# Altium project ECG_Multi_Lead.PrjPcb (part 1 of 2)
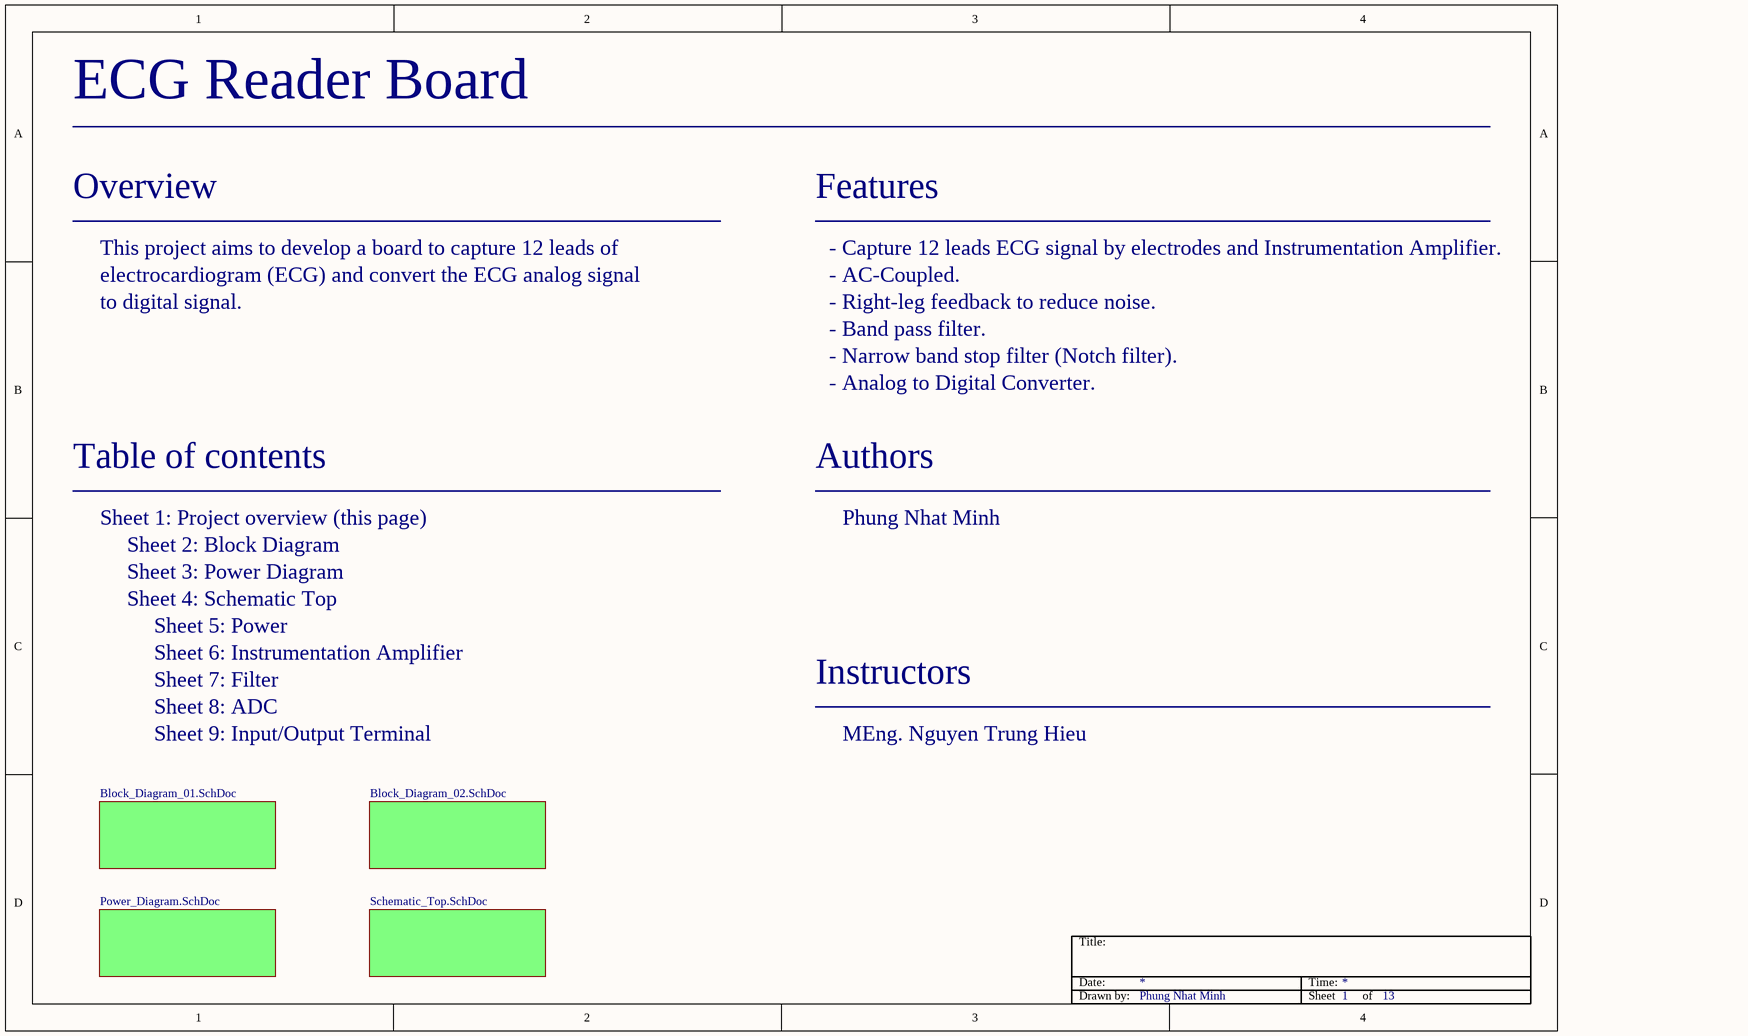
[diagram p0: Project_Overview.SchDoc]
14 sheets, 218 parts. Net scope: flat (ports and power ports of the same name join across sheets).
Board file: PCB_ECG_Multi_Lead.PcbDoc
Sheets:
  Project_Overview.SchDoc
    Designator = Block_Diagram_01.SchDoc
    Designator = Power_Diagram.SchDoc
    Designator = Schematic_Top.SchDoc
      Designator = SCH_03_Instrumentation_Amplifier.SchDoc
      Designator = SCH_08_ADC.SchDoc
      Designator = SCH_01_Power.SchDoc
      Designator = SCH_06_Analog_Mux.SchDoc
      Designator = SCH_09_InOut_Terminal.SchDoc
      Designator = SCH_02_Electrodes.SchDoc
      Designator = SCH_05_WCT_RLD.SchDoc
      Designator = SCH_07_Filter.SchDoc
      Designator = SCH_04_Chest_Lead_Amplifier.SchDoc
    Designator = Block_Diagram_02.SchDoc

## Sheet Project_Overview.SchDoc
size A4; SheetNumber: 1; SheetTotal: 13; BoardName: ECG Reader Board

### Sub-sheets
Designator = Block_Diagram_01.SchDoc: no entries
Designator = Power_Diagram.SchDoc: no entries
Designator = Schematic_Top.SchDoc: no entries
Designator = Block_Diagram_02.SchDoc: no entries

### Notes on the sheet
- Overview
- Features
- This project aims to develop a board to capture 12 leads of
- electrocardiogram (ECG) and convert the ECG analog signal
- to digital signal.
- - Right-leg feedback to reduce noise.
- - AC-Coupled.
- - Capture 12 leads ECG signal by electrodes and Instrumentation Amplifier.
- - Narrow band stop filter (Notch filter).
- - Band pass filter.
- - Analog to Digital Converter.
- Table of contents
- Authors
- Sheet 1: Project overview (this page)
- Sheet 2: Block Diagram
- Sheet 3: Power Diagram
- Phung Nhat Minh
- Sheet 4: Schematic Top
- Sheet 5: Power
- Sheet 7: Filter
- Sheet 6: Instrumentation Amplifier
- Sheet 8: ADC
- Instructors
- Sheet 9: Input/Output Terminal
- MEng. Nguyen Trung Hieu
- Title:
- Date:
- Time:
- Drawn by:
- Sheet
- of

## Sheet Block_Diagram_01.SchDoc
size A4; SheetNumber: 2; SheetTotal: 13
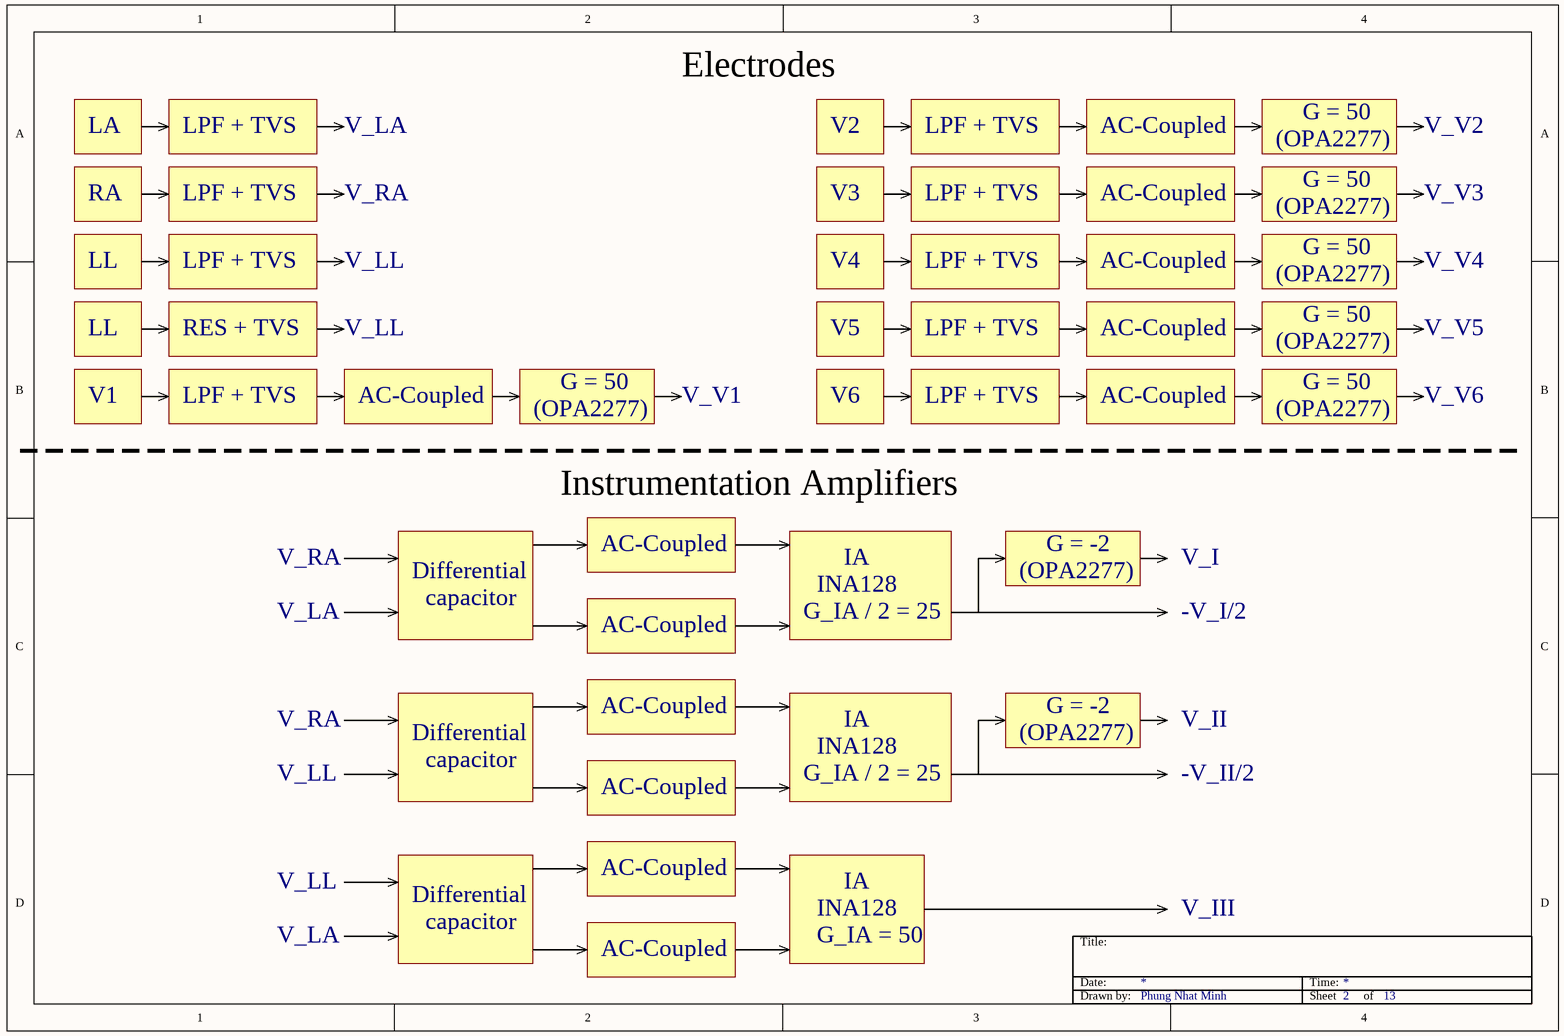
[diagram p1: Block_Diagram_01.SchDoc]

### Notes on the sheet
- Electrodes
- LA
- LPF + TVS
- V_LA
- V2
- AC-Coupled
- (OPA2277)
- G = 50
- V_V2
- RA
- V_RA
- V3
- V_V3
- LL
- V_LL
- V4
- V_V4
- RES + TVS
- V5
- V_V5
- V1
- V_V1
- V6
- V_V6
- Instrumentation Amplifiers
- Differential
- IA
- G = -2
- V_I
- capacitor
- G_IA / 2 = 25
- INA128
- -V_I/2
- V_II
- -V_II/2
- V_III
- G_IA = 50
- Title:
- Date:
- Time:
- Drawn by:
- Phung Nhat Minh
- Sheet
- of

## Sheet Power_Diagram.SchDoc
size A4; SheetNumber: 4; SheetTotal: 14
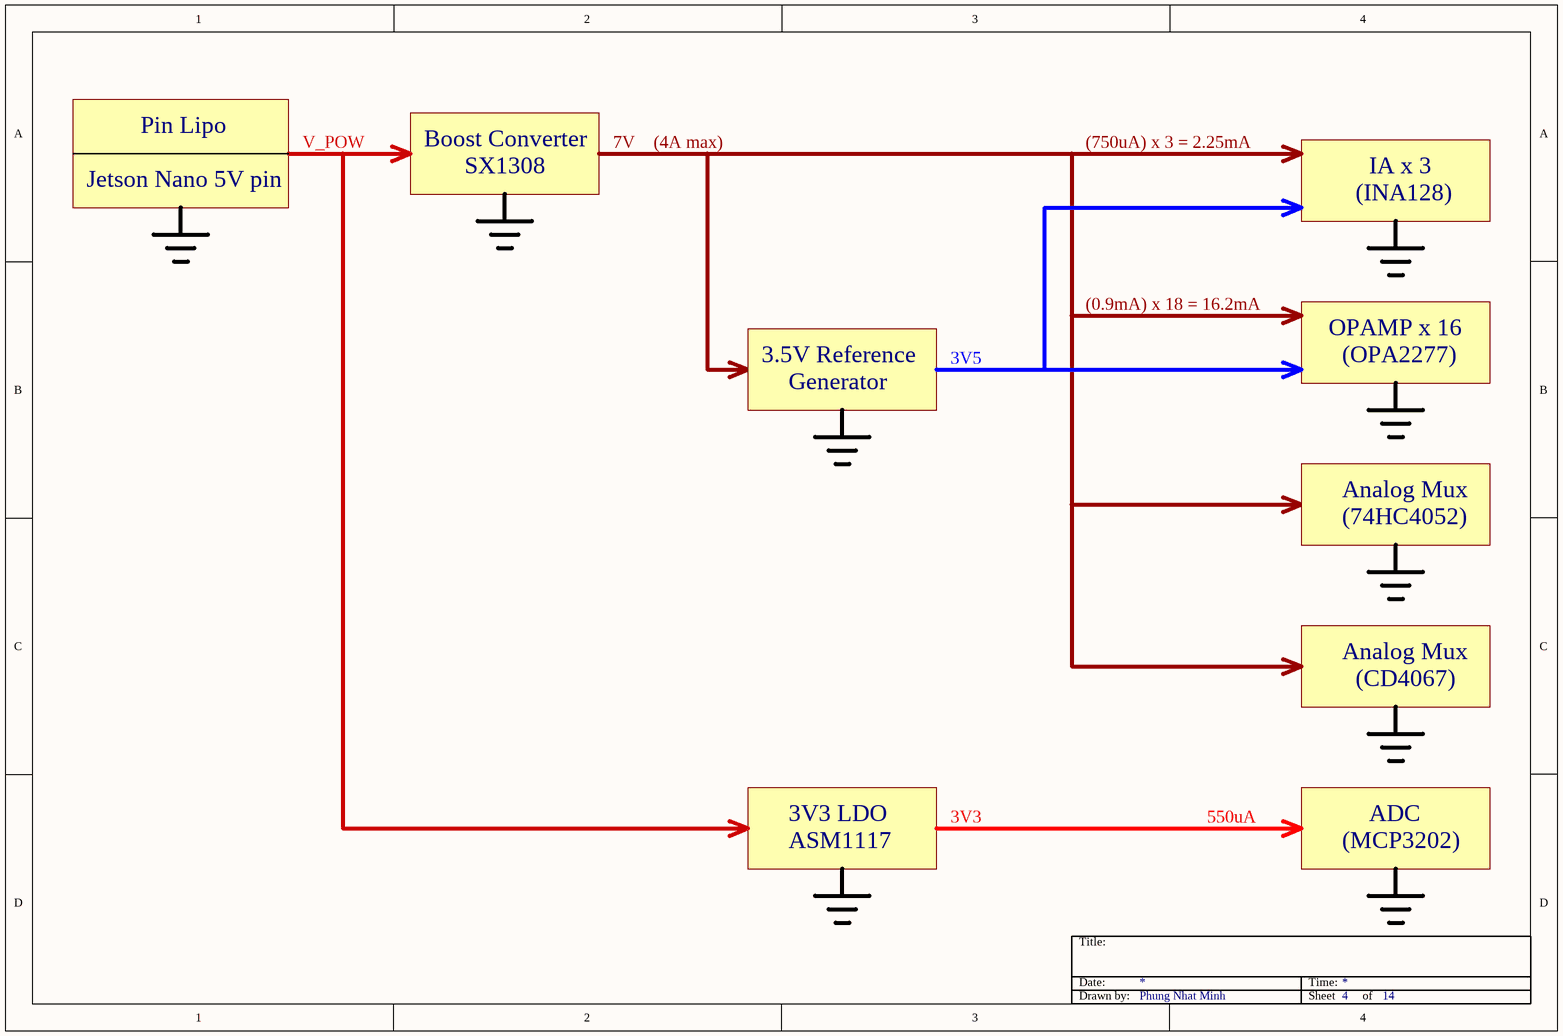
[diagram p2: Power_Diagram.SchDoc]

### Notes on the sheet
- Pin Lipo
- V_POW
- Boost Converter
- SX1308
- 7V
- (4A max)
- (750uA) x 3 = 2.25mA
- IA x 3
- Jetson Nano 5V pin
- (INA128)
- (0.9mA) x 18 = 16.2mA
- 3.5V Reference
- 3V5
- OPAMP x 16
- (OPA2277)
- Generator
- Analog Mux
- (74HC4052)
- (CD4067)
- 3V3 LDO
- ASM1117
- 3V3
- 550uA
- (MCP3202)
- ADC
- Title:
- Date:
- Time:
- Drawn by:
- Phung Nhat Minh
- Sheet
- of

## Sheet Schematic_Top.SchDoc
size A4; SheetNumber: 5; SheetTotal: 14
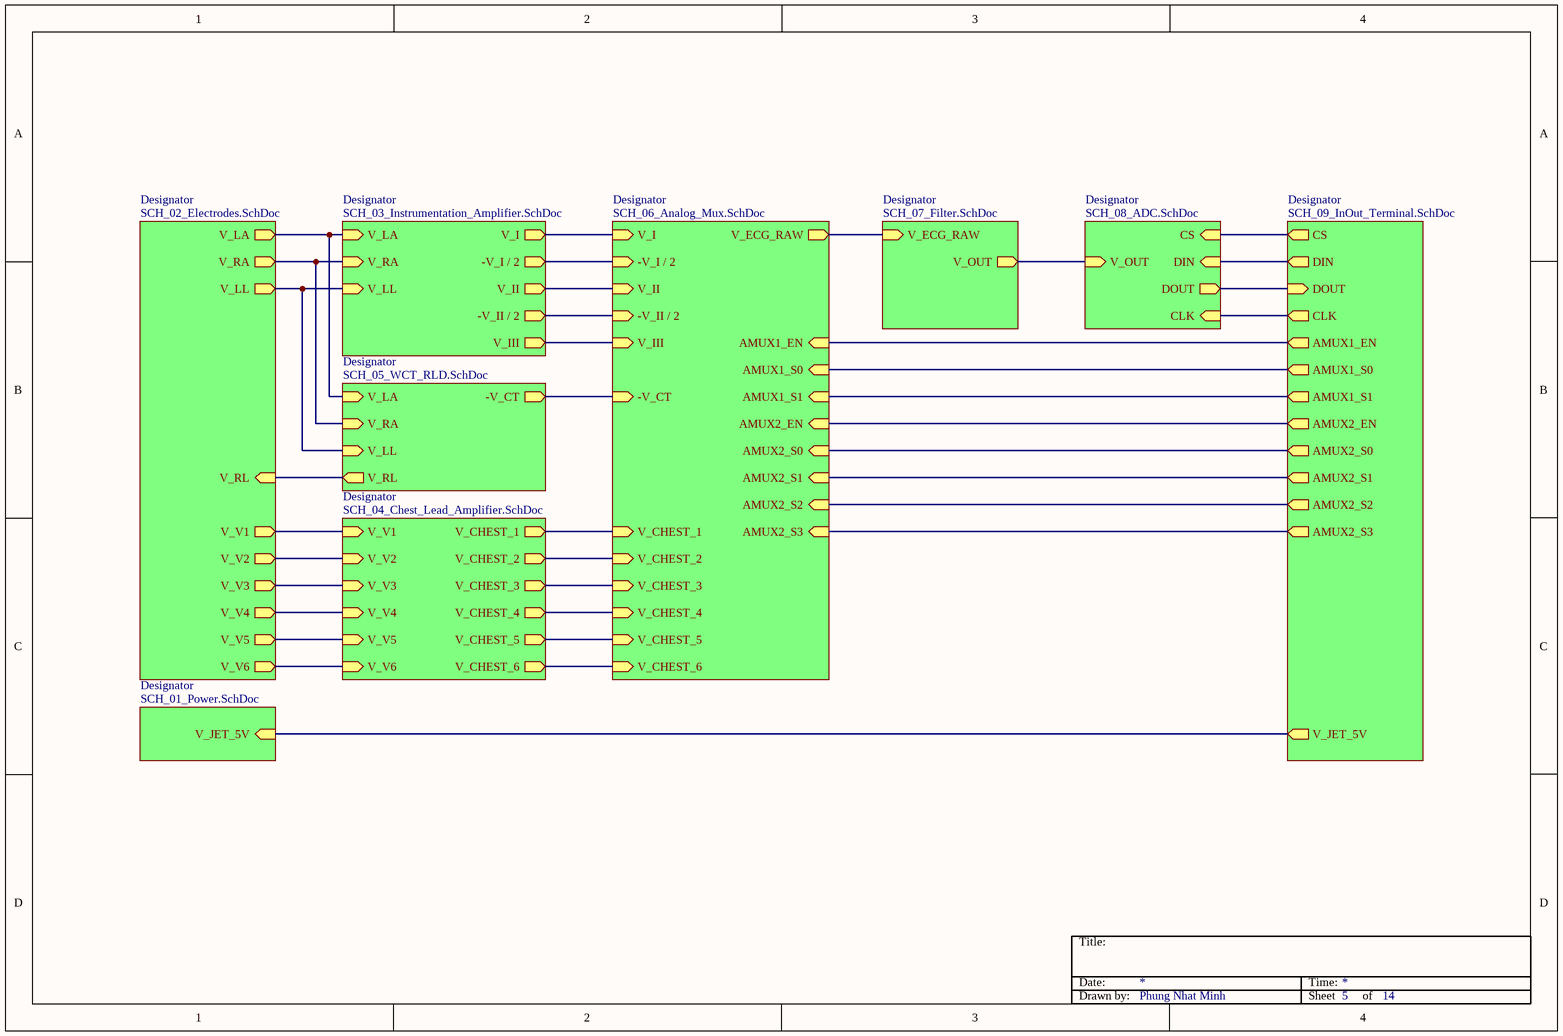
[diagram p3: Schematic_Top.SchDoc]

### Sub-sheets
Designator = SCH_03_Instrumentation_Amplifier.SchDoc: V_I (out), V_LA (in), V_RA (in), V_LL (in), -V_I / 2 (out), V_II (out), -V_II / 2 (out), V_III (out)
Designator = SCH_08_ADC.SchDoc: V_OUT (in), CS (in), DOUT (out), DIN (in), CLK (in)
Designator = SCH_01_Power.SchDoc: V_JET_5V (in)
Designator = SCH_06_Analog_Mux.SchDoc: V_ECG_RAW (out), AMUX1_S0 (in), AMUX1_S1 (in), AMUX2_S0 (in), AMUX2_S1 (in), AMUX2_S2 (in), AMUX2_S3 (in), V_I (in), -V_I / 2 (in), V_II (in), -V_II / 2 (in), V_III (in), -V_CT (in), V_CHEST_1 (in), V_CHEST_2 (in), V_CHEST_3 (in), V_CHEST_4 (in), V_CHEST_5 (in), V_CHEST_6 (in), AMUX2_EN (in), AMUX1_EN (in)
Designator = SCH_09_InOut_Terminal.SchDoc: DIN (out), CS (out), DOUT (in), CLK (out), AMUX1_S0 (out), AMUX1_S1 (out), AMUX2_S0 (out), AMUX2_S1 (out), AMUX2_S2 (out), AMUX2_S3 (out), V_JET_5V (out), AMUX2_EN (out), AMUX1_EN (out)
Designator = SCH_02_Electrodes.SchDoc: V_LA (out), V_RA (out), V_LL (out), V_V1 (out), V_V2 (out), V_V3 (out), V_V4 (out), V_V5 (out), V_V6 (out), V_RL (in)
Designator = SCH_05_WCT_RLD.SchDoc: V_LA (in), V_RA (in), V_LL (in), V_RL (out), -V_CT (out)
Designator = SCH_07_Filter.SchDoc: V_OUT (out), V_ECG_RAW (in)
Designator = SCH_04_Chest_Lead_Amplifier.SchDoc: V_V1 (in), V_V2 (in), V_V3 (in), V_V4 (in), V_V5 (in), V_V6 (in), V_CHEST_1 (out), V_CHEST_2 (out), V_CHEST_3 (out), V_CHEST_4 (out), V_CHEST_5 (out), V_CHEST_6 (out)

### Nets
(unnamed): sheet Designator/V_I, sheet Designator/V_I
(unnamed): sheet Designator/V_LA, sheet Designator/V_LA, sheet Designator/V_LA
(unnamed): sheet Designator/V_RA, sheet Designator/V_RA, sheet Designator/V_RA
(unnamed): sheet Designator/V_LL, sheet Designator/V_LL, sheet Designator/V_LL
(unnamed): sheet Designator/-V_I / 2, sheet Designator/-V_I / 2
(unnamed): sheet Designator/V_II, sheet Designator/V_II
(unnamed): sheet Designator/-V_II / 2, sheet Designator/-V_II / 2
(unnamed): sheet Designator/V_III, sheet Designator/V_III
(unnamed): sheet Designator/V_OUT, sheet Designator/V_OUT
(unnamed): sheet Designator/CS, sheet Designator/CS
(unnamed): sheet Designator/DOUT, sheet Designator/DOUT
(unnamed): sheet Designator/DIN, sheet Designator/DIN
(unnamed): sheet Designator/CLK, sheet Designator/CLK
(unnamed): sheet Designator/V_JET_5V, sheet Designator/V_JET_5V
(unnamed): sheet Designator/V_ECG_RAW, sheet Designator/V_ECG_RAW
(unnamed): sheet Designator/AMUX1_S0, sheet Designator/AMUX1_S0
(unnamed): sheet Designator/AMUX1_S1, sheet Designator/AMUX1_S1
(unnamed): sheet Designator/AMUX2_S0, sheet Designator/AMUX2_S0
(unnamed): sheet Designator/AMUX2_S1, sheet Designator/AMUX2_S1
(unnamed): sheet Designator/AMUX2_S2, sheet Designator/AMUX2_S2
(unnamed): sheet Designator/AMUX2_S3, sheet Designator/AMUX2_S3
(unnamed): sheet Designator/-V_CT, sheet Designator/-V_CT
(unnamed): sheet Designator/V_CHEST_1, sheet Designator/V_CHEST_1
(unnamed): sheet Designator/V_CHEST_2, sheet Designator/V_CHEST_2
(unnamed): sheet Designator/V_CHEST_3, sheet Designator/V_CHEST_3
(unnamed): sheet Designator/V_CHEST_4, sheet Designator/V_CHEST_4
(unnamed): sheet Designator/V_CHEST_5, sheet Designator/V_CHEST_5
(unnamed): sheet Designator/V_CHEST_6, sheet Designator/V_CHEST_6
(unnamed): sheet Designator/AMUX2_EN, sheet Designator/AMUX2_EN
(unnamed): sheet Designator/AMUX1_EN, sheet Designator/AMUX1_EN
(unnamed): sheet Designator/V_V1, sheet Designator/V_V1
(unnamed): sheet Designator/V_V2, sheet Designator/V_V2
(unnamed): sheet Designator/V_V3, sheet Designator/V_V3
(unnamed): sheet Designator/V_V4, sheet Designator/V_V4
(unnamed): sheet Designator/V_V5, sheet Designator/V_V5
(unnamed): sheet Designator/V_V6, sheet Designator/V_V6
(unnamed): sheet Designator/V_RL, sheet Designator/V_RL

### Notes on the sheet
- Title:
- Date:
- Time:
- Drawn by:
- Phung Nhat Minh
- Sheet
- of

## Sheet SCH_03_Instrumentation_Amplifier.SchDoc
size A4; SheetNumber: 8; SheetTotal: 14; SPICEModelCacheUCDMULDR: <root> / <DocumentId>UCDMULDR</DocumentId> / </root>
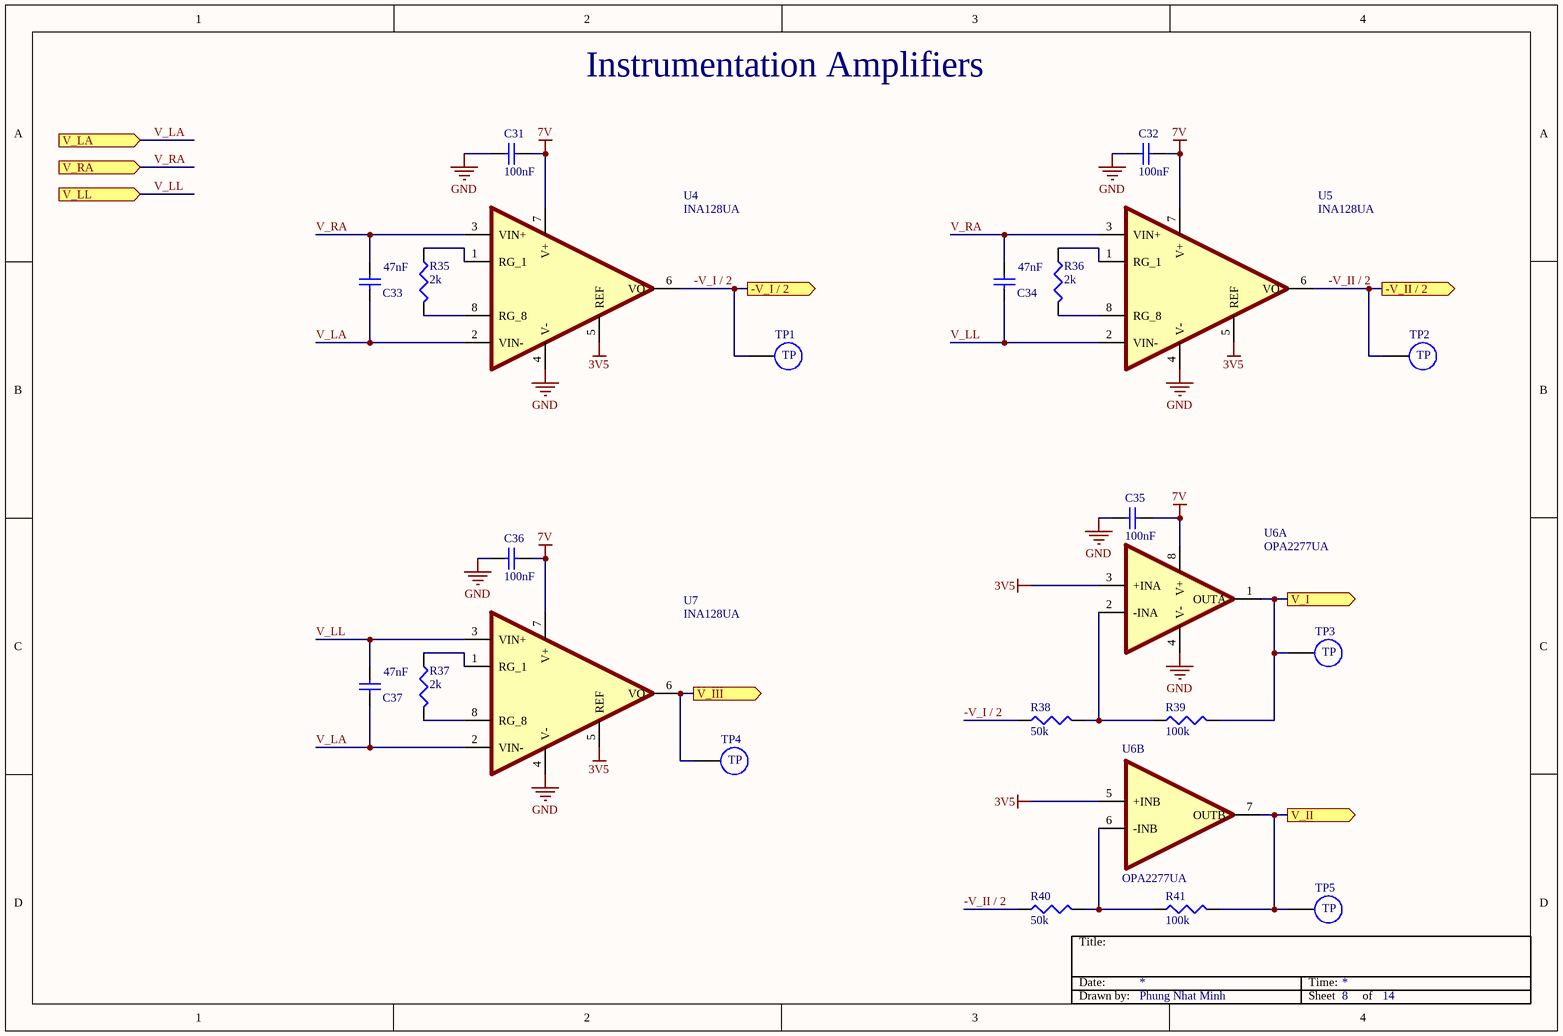
[diagram p4: SCH_03_Instrumentation_Amplifier.SchDoc]

### Parts
C31  100nF  [WCAP-CSGP_0603_L1.6W0.8H0.8_Reflow]
C32  100nF  [WCAP-CSGP_0603_L1.6W0.8H0.8_Reflow]
C33  47nF  [WCAP-CSGP_0603_L1.6W0.8H0.8_Reflow]
C34  47nF  [WCAP-CSGP_0603_L1.6W0.8H0.8_Reflow]
C35  100nF  [WCAP-CSGP_0603_L1.6W0.8H0.8_Reflow]
C36  100nF  [WCAP-CSGP_0603_L1.6W0.8H0.8_Reflow]
C37  47nF  [WCAP-CSGP_0603_L1.6W0.8H0.8_Reflow]
R35  2k  [WRIS-PSMB_0603_L1.6W0.8H0.35]
R36  2k  [WRIS-PSMB_0603_L1.6W0.8H0.35]
R37  2k  [WRIS-PSMB_0603_L1.6W0.8H0.35]
R38  50k  [WRIS-PSMB_0603_L1.6W0.8H0.35]
R39  100k  [WRIS-PSMB_0603_L1.6W0.8H0.35]
R40  50k  [WRIS-PSMB_0603_L1.6W0.8H0.35]
R41  100k  [WRIS-PSMB_0603_L1.6W0.8H0.35]
TP1  Pad_Test_Point  [Pad_Test_Point]  (value not drawn)
TP2  Pad_Test_Point  [Pad_Test_Point]  (value not drawn)
TP3  Pad_Test_Point  [Pad_Test_Point]  (value not drawn)
TP4  Pad_Test_Point  [Pad_Test_Point]  (value not drawn)
TP5  Pad_Test_Point  [Pad_Test_Point]  (value not drawn)
U4  INA128UA  [SOIC127P599X175-8N]
U5  INA128UA  [SOIC127P599X175-8N]
U6  OPA2277UA  [SOIC127P599X175-8N]  (parts A,B of 2)
U7  INA128UA  [SOIC127P599X175-8N]

### Ports
-V_I / 2 (out, see Schematic_Top[2B], SCH_06_Analog_Mux[2B]), -V_II / 2 (out, see Schematic_Top[2B], SCH_06_Analog_Mux[2C]), V_I (out, see Schematic_Top[2A], SCH_06_Analog_Mux[2B]), V_II (out, see Schematic_Top[2B], SCH_06_Analog_Mux[2C]), V_III (out, see Schematic_Top[2B], SCH_06_Analog_Mux[2C]), V_LA (in, see Schematic_Top[1A], SCH_02_Electrodes[2A], SCH_05_WCT_RLD[1A]), V_LL (in, see Schematic_Top[1B], SCH_02_Electrodes[2B], SCH_05_WCT_RLD[1B]), V_RA (in, see Schematic_Top[1B], SCH_02_Electrodes[2A], SCH_05_WCT_RLD[1B])

### Nets
3V5: U4.5(REF) U5.5(REF) U6.3(+INA) U6.5(+INB) U7.5(REF)
7V: C31.1 C32.1 C35.1 C36.1 U4.7(V+) U5.7(V+) U6.8(V+) U7.7(V+)
GND: C31.2 C32.2 C35.2 C36.2 U4.4(V-) U5.4(V-) U6.4(V-) U7.4(V-)
-V_I / 2: R38.1 TP1.1 U4.6(VO) ; port -V_I / 2
-V_II / 2: R40.1 TP2.1 U5.6(VO) ; port -V_II / 2
V_LA: C33.1 C37.1 U4.2(VIN-) U7.2(VIN-) ; port V_LA
V_LL: C34.1 C37.2 U5.2(VIN-) U7.3(VIN+) ; port V_LL
V_RA: C33.2 C34.2 U4.3(VIN+) U5.3(VIN+) ; port V_RA
NetR35_1: R35.1 U4.1(RG_1)
NetR35_2: R35.2 U4.8(RG_8)
NetR36_1: R36.1 U5.1(RG_1)
NetR36_2: R36.2 U5.8(RG_8)
NetR37_1: R37.1 U7.1(RG_1)
NetR37_2: R37.2 U7.8(RG_8)
NetR38_2: R38.2 R39.1 U6.2(-INA)
NetR39_2: R39.2 TP3.1 U6.1(OUTA) ; port V_I
NetR40_2: R40.2 R41.1 U6.6(-INB)
NetR41_2: R41.2 TP5.1 U6.7(OUTB) ; port V_II
NetTP4_1: TP4.1 U7.6(VO) ; port V_III

### Notes on the sheet
- Instrumentation Amplifiers
- Title:
- Date:
- Time:
- Drawn by:
- Phung Nhat Minh
- Sheet
- of
- (in symbol Pad_Test_Point) TP

### Library data of the parts
C31 C32 C35 C36 = 885012206095: WCAP-CSGP Multilayer Ceramic Chip Capacitor, General Purpose, size 0603, X7R, 100nF, 50VDC; Manufacturer: Wurth Elektronik; Case/Size Code: 0603; Capacitance Tolerance: +/-10%; Dissipation Factor: 3%; Insulation Resistance: 5GOhm; Rated Voltage (DC): 50V; Technical Reference: X7R0603104K050DFCT10000; Manufacturer Part Number: 885012206095; Category: Multilayer Ceramic Chip Capacitors; Match Code: WCAP-CSGP; ComponentLink1Description: Website Link; ComponentLink1URL: https://www.we-online.com/redexpert/article/885012206095?ad; ComponentLink2Description: Datasheet Link; ComponentLink2URL: https://www.we-online.com/redexpert/spec/885012206095?ad; Mount: Surface Mount; Operating Temperature Max: 125°C; Operating Temperature Min: -55°C; Packaging: Tape and Reel; Length: 1.6mm; Width: 0.8mm; Height: 0.8mm; Capacitance: 100nF; Ceramic Type: X7R
C33 C34 C37 = 885012206093: WCAP-CSGP Multilayer Ceramic Chip Capacitor, General Purpose, size 0603, X7R, 47nF, 50VDC; Manufacturer: Wurth Elektronik; Case/Size Code: 0603; Capacitance Tolerance: +/-10%; Dissipation Factor: 3%; Insulation Resistance: 10GOhm; Rated Voltage (DC): 50V; Technical Reference: X7R0603473K050DFCT10000; Manufacturer Part Number: 885012206093; Category: Multilayer Ceramic Chip Capacitors; Match Code: WCAP-CSGP; ComponentLink1Description: Website Link; ComponentLink1URL: https://www.we-online.com/redexpert/article/885012206093?ad; ComponentLink2Description: Datasheet Link; ComponentLink2URL: https://www.we-online.com/redexpert/spec/885012206093?ad; Mount: Surface Mount; Operating Temperature Max: 125°C; Operating Temperature Min: -55°C; Packaging: Tape and Reel; Length: 1.6mm; Width: 0.8mm; Height: 0.8mm; Capacitance: 47nF; Ceramic Type: X7R
R35-R41 = 580060716001: WRIS-PSMB Metal Plate Resistor, SMT, size 0603, 0.33W, 5mΩ, +/-1%; Manufacturer: Wurth Elektronik; Case/Size Code: 0603; Rated Current: 8.12A; Technical Reference: MB0603R005F103KAATP0000; Temperature Coefficient of Resistance: +/-100ppm/°C; Manufacturer Part Number: 580060716001; Category: Metal Plate Resistors; Match Code: WRIS-PSMB; ComponentLink1Description: Website Link; ComponentLink1URL: https://www.we-online.com/redexpert/article/580060716001?ad; ComponentLink2Description: Datasheet Link; ComponentLink2URL: https://www.we-online.com/redexpert/spec/580060716001?ad; Mount: Surface Mount; Operating Temperature Max: 155°C; Operating Temperature Min: -55°C; Packaging: Tape and Reel; Length: 1.6mm; Width: 0.8mm; Height: 0.35mm; Rated Power: 0.33W; Resistance: 5mΩ; Resistance Tolerance: +/-1%
U4 U5 U7 = INA128UA: Precision, 130-dB CMRR, 700-A, Low-Power, Instrumentation Amplifier 8-SOIC -40 to 125; MP: INA128UA/2K5; MF: Texas Instruments; Value: *; Package: SOIC-8 Texas Instruments; Availability: Good; SnapEDA_Link: https://www.snapeda.com/parts/INA128UA/2K5/Texas%20Instruments/view-part/1191532/?ref=snap; Price: None; Purchase-URL: https://pricing.snapeda.com/search/part/INA128UA/2K5/?ref=eda
U6 = OPA2277UA: MP: OPA2227UA; Package: None; Price: None; Value: *; Availability: Unavailable

## Sheet SCH_08_ADC.SchDoc
size A4; SheetNumber: 13; SheetTotal: 14; SPICEModelCacheAFFBQUIG: <root> / <DocumentId>AFFBQUIG</DocumentId> / <CacheFrame Number="0"> / <Model Name="0603_885012106031_10uf" Kind="CKT"> / <Text>******* / .subckt 0603_885012106031_10uF 1 2 / Rser 1 3 0.0105 / Lser 2 4 0.0000000008 / C1 3 4 0.00001 / Rpar 3 4 10000000 / .ends 0603_885012106031_10uF</Text> / </Model> / <Model Name="0603_885012206095_100nf" Kind="CKT"> / <Text>******* / .subckt 0603_885012206095_100nF 1 2 / Rser 1 3 0.0157659152881 / Lser 2 4 3.10171966E-10 / C1 3 4 0.0000001 / Rpar 3 4 5000000000 / .ends 0603_885012206095_100nF</Text> / </Model> / </CacheFrame> / </root>
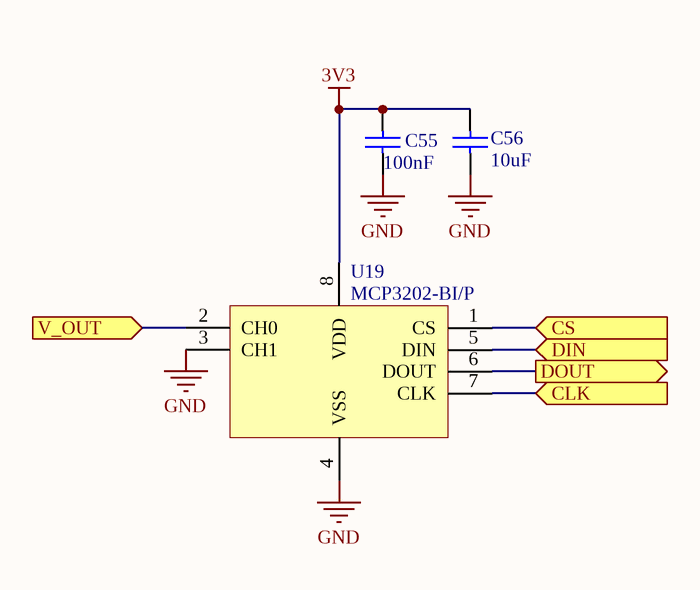
[diagram p5: SCH_08_ADC.SchDoc]

### Parts
C55  100nF  [WCAP-CSGP_0603_L1.6W0.8H0.8_Reflow]
C56  10uF  [WCAP-CSGP_0603_L1.6W0.8H0.8_Reflow]
U19  MCP3202-BI/P  [DIP787W46P254L927H533Q8]

### Ports
CLK (in, see Schematic_Top[4B], SCH_09_InOut_Terminal[3B]), CS (in, see Schematic_Top[4A], SCH_09_InOut_Terminal[2B]), DIN (in, see Schematic_Top[4B], SCH_09_InOut_Terminal[3B]), DOUT (out, see Schematic_Top[4B], SCH_09_InOut_Terminal[3B]), V_OUT (in, see Schematic_Top[3B], SCH_07_Filter[4B])

### Nets
3V3: C55.2 C56.2 U19.8(VDD)
GND: C55.1 C56.1 U19.3(CH1) U19.4(VSS)
NetJ5_19: U19.5(DIN) ; port DIN
NetJ5_21: U19.6(DOUT) ; port DOUT
NetJ5_23: U19.7(CLK) ; port CLK
NetJ5_26: U19.1(CS) ; port CS
NetR89_1: U19.2(CH0) ; port V_OUT

### Notes on the sheet
- Title:
- Date:
- Time:
- Drawn by:
- Phung Nhat Minh
- Sheet
- of

### Library data of the parts
C55 = 885012206095: as C31 on sheet SCH_03_Instrumentation_Amplifier; Manufacturer Part Number: 885012206095; Category: Multilayer Ceramic Chip Capacitors; Match Code: WCAP-CSGP; ComponentLink1Description: Website Link; ComponentLink1URL: https://www.we-online.com/redexpert/article/885012206095?ad; ComponentLink2Description: Datasheet Link; ComponentLink2URL: https://www.we-online.com/redexpert/spec/885012206095?ad; Mount: Surface Mount; Operating Temperature Max: 125°C; Operating Temperature Min: -55°C; Packaging: Tape and Reel; Length: 1.6mm; Width: 0.8mm; Height: 0.8mm; Capacitance: 100nF; Ceramic Type: X7R
C56 = 885012106031: WCAP-CSGP Multilayer Ceramic Chip Capacitor, General Purpose, size 0603, X5R, 10uF, 25VDC; Manufacturer: Wurth Elektronik; Case/Size Code: 0603; Capacitance Tolerance: +/20%; Dissipation Factor: 20%; Insulation Resistance: 0.01GOhm; Rated Voltage (DC): 25V; Technical Reference: X5R0603106M025DFCT10000; Manufacturer Part Number: 885012106031; Category: Multilayer Ceramic Chip Capacitors; Match Code: WCAP-CSGP; ComponentLink1Description: Website Link; ComponentLink1URL: https://www.we-online.com/redexpert/article/885012106031?ad; ComponentLink2Description: Datasheet Link; ComponentLink2URL: https://www.we-online.com/redexpert/spec/885012106031?ad; Mount: Surface Mount; Operating Temperature Max: 85°C; Operating Temperature Min: -55°C; Packaging: Tape and Reel; Length: 1.6mm; Width: 0.8mm; Height: 0.8mm; Capacitance: 10uF; Ceramic Type: X5R

## Sheet SCH_01_Power.SchDoc
size A4; SheetNumber: 6; SheetTotal: 14; SPICEModelCacheESGLKFNC: <root> / <DocumentId>ESGLKFNC</DocumentId> / </root>
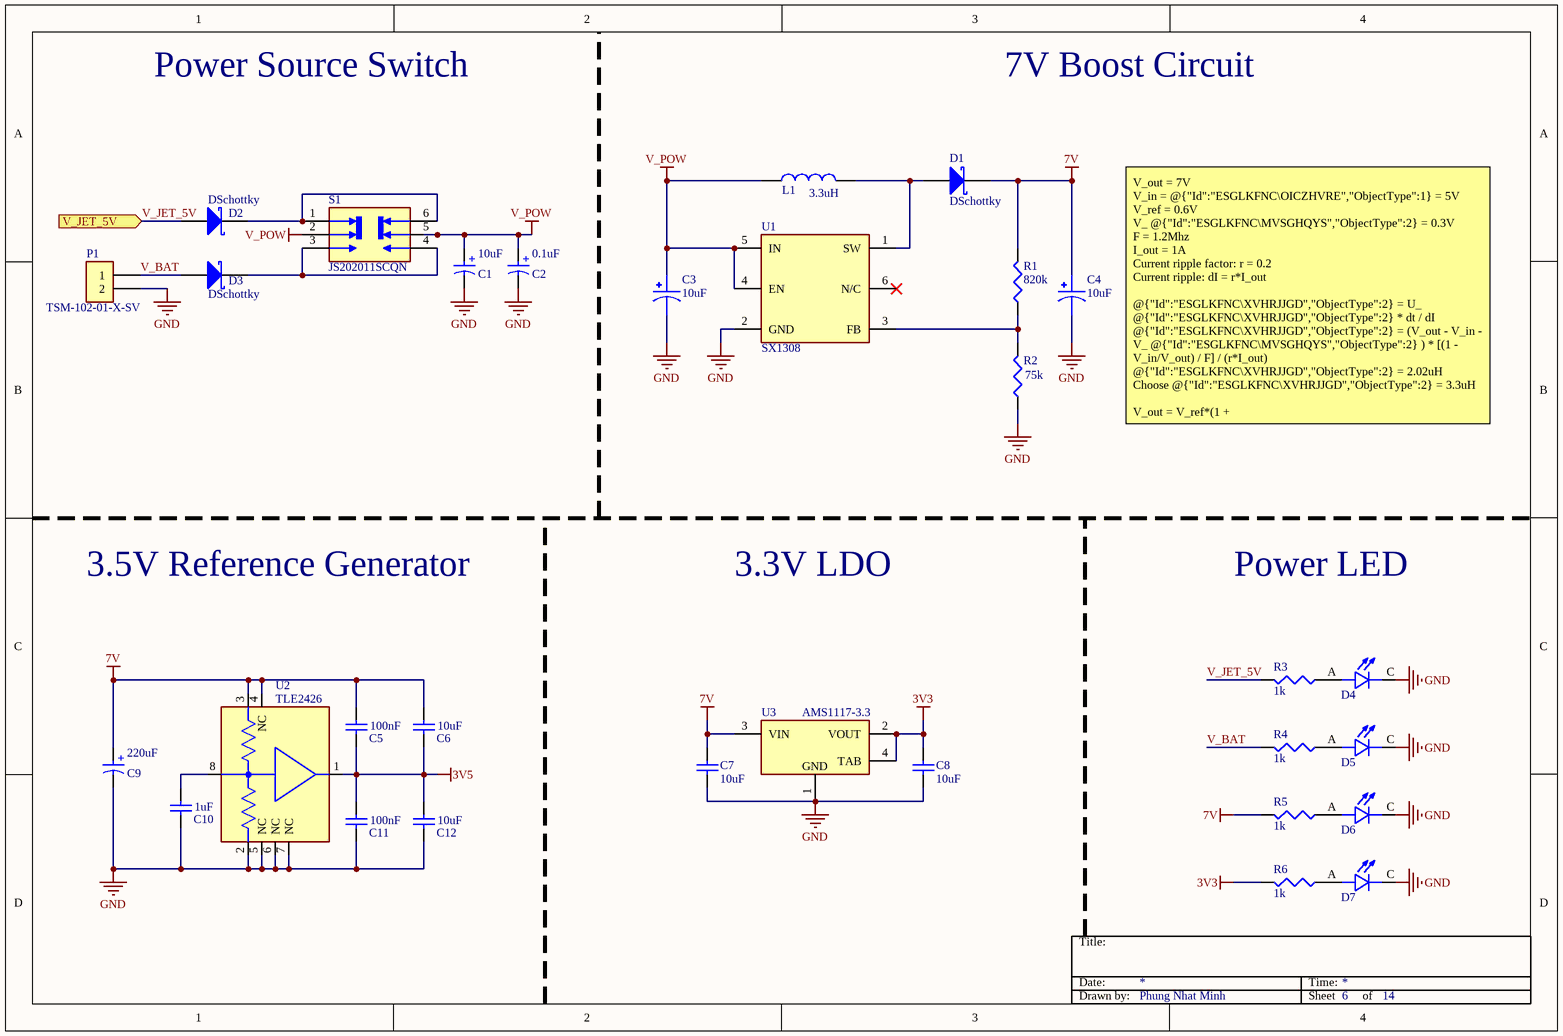
[diagram p6: SCH_01_Power.SchDoc]

### Parts
C1  10uF  [WCAP-ASLI_D4H5.5]
C2  0.1uF  [WCAP-ASLI_D4H5.5]
C3  10uF  [CAPPM6032X280N]
C4  10uF  [CAPPM6032X280N]
C5  100nF  [WCAP-CSGP_0603_L1.6W0.8H0.8_Reflow]
C6  10uF  [WCAP-CSGP_0603_L1.6W0.8H0.8_Reflow]
C7  10uF  [WCAP-CSGP_0603_L1.6W0.8H0.8_Reflow]
C8  10uF  [WCAP-CSGP_0603_L1.6W0.8H0.8_Reflow]
C9  220uF  [WCAP-ASLI_D6.3H7.7]
C10  1uF  [WCAP-CSGP_0603_L1.6W0.8H0.8_Reflow]
C11  100nF  [WCAP-CSGP_0603_L1.6W0.8H0.8_Reflow]
C12  10uF  [WCAP-CSGP_0603_L1.6W0.8H0.8_Reflow]
D1  DSchottky  [PCBComponent_1]
D2  DSchottky  [PCBComponent_1]
D3  DSchottky  [PCBComponent_1]
D4  SML-LXT0805IW-TR  [LEDC2012X120N]  (value not drawn)
D5  SML-LXT0805IW-TR  [LEDC2012X120N]  (value not drawn)
D6  SML-LXT0805IW-TR  [LEDC2012X120N]  (value not drawn)
D7  SML-LXT0805IW-TR  [LEDC2012X120N]  (value not drawn)
L1  3.3uH  [WE-PD2A_4532]
P1  TSM-102-01-X-SV  [SAMTEC_TSM-102-01-X-SV]
R1  820k  [WRIS-PSMB_0603_L1.6W0.8H0.35]
R2  75k  [WRIS-PSMB_0603_L1.6W0.8H0.35]
R3  1k  [WRIS-PSMB_0603_L1.6W0.8H0.35]
R4  1k  [WRIS-PSMB_0603_L1.6W0.8H0.35]
R5  1k  [WRIS-PSMB_0603_L1.6W0.8H0.35]
R6  1k  [WRIS-PSMB_0603_L1.6W0.8H0.35]
S1  JS202011SCQN  [SW_JS202011SCQN]
U1  SX1308  [SOT-23-6]
U2  TLE2426  [SO8]
U3  AMS1117-3.3  [SOT229P700X180-4N]

### Ports
V_JET_5V (in, see Schematic_Top[1C], SCH_09_InOut_Terminal[2C])

### Nets
3V3: C8.2 R6.2 U3.2(VOUT) U3.4(TAB)
3V5: C5.1 C6.1 C11.2 C12.2 U2.1(OUT)
7V: C4.1 C5.2 C6.2 C7.2 C9.1(P) D1.2(K) R1.2 R5.2 U2.3(V+) U2.4(NC) U3.3(VIN)
GND: C1.2(N) C2.2(N) C3.2 C4.2 C7.1 C8.1 C9.2(N) C10.1 C11.1 C12.1 D4.C D5.C D6.C D7.C P1.2 R2.1 U1.2(GND) U2.2(V-) U2.5(NC) U2.6(NC) U2.7(NC) U3.1(GND/ADJ)
V_POW: C1.1(P) C2.1(P) C3.1 L1.1 S1.2 S1.5 U1.4(EN) U1.5(IN)
V_BAT: D3.1(A) P1.1 R4.2
V_JET_5V: D2.1(A) R3.2 ; port V_JET_5V
NetC10_2: C10.2 U2.8(NR)
NetD1_1: D1.1(A) L1.2 U1.1(SW)
NetD2_2: D2.2(K) S1.1 S1.6
NetD3_2: D3.2(K) S1.3 S1.4
NetD4_A: D4.A R3.1
NetD5_A: D5.A R4.1
NetD6_A: D6.A R5.1
NetD7_A: D7.A R6.1
NetR1_1: R1.1 R2.2 U1.3(FB)

Not connected (* = marked no-connect by the designer): U1 6(N/C)*

### Notes on the sheet
- Power Source Switch
- 7V Boost Circuit
- V_out = 7V
  V_in = @{"Id":"ESGLKFNC\OICZHVRE","ObjectType":1} = 5V
  V_ref = 0.6V
  V_ @{"Id":"ESGLKFNC\MVSGHQYS","ObjectType":2} = 0.3V
  F = 1.2Mhz
  I_out = 1A
  Current ripple factor: r = 0.2
  Current ripple: dI = r*I_out
  @{"Id":"ESGLKFNC\XVHRJJGD","ObjectType":2} = U_ @{"Id":"ESGLKFNC\XVHRJJGD","ObjectType":2} * dt / dI
  @{"Id":"ESGLKFNC\XVHRJJGD","ObjectType":2} = (V_out - V_in - V_ @{"Id":"ESGLKFNC\MVSGHQYS","ObjectType":2} ) * [(1 - V_in/V_out) / F] / (r*I_out)
  @{"Id":"ESGLKFNC\XVHRJJGD","ObjectType":2} = 2.02uH
  Choose @{"Id":"ESGLKFNC\XVHRJJGD","ObjectType":2} = 3.3uH
  V_out = V_ref*(1 + @{"Id":"ESGLKFNC\TLFOOIWW","ObjectType":2} / @{"Id":"ESGLKFNC\CCQALEBM","ObjectType":2} )
  @{"Id":"ESGLKFNC\TLFOOIWW","ObjectType":2} + @{"Id":"ESGLKFNC\CCQALEBM","ObjectType":2} ≈ 1M
  Choose @{"Id":"ESGLKFNC\TLFOOIWW","ObjectType":2} = 820k, @{"Id":"ESGLKFNC\CCQALEBM","ObjectType":2} = 75k.
- 3.5V Reference Generator
- 3.3V LDO
- Power LED
- Title:
- Date:
- Time:
- Drawn by:
- Phung Nhat Minh
- Sheet
- of
- (in symbol 865080245009) +
- (in symbol 865080440002) +
- (in symbol 865080740002) +
- (in symbol AMS1117-5.0) GND

### Library data of the parts
C1 = 865080440002: WCAP-ASLI Aluminum Electrolytic Capacitor, V-Chip, D4 x H5.5mm, 10uF, 25V; Manufacturer: Wurth Elektronik; Capacitance Tolerance: +/-20%; Dissipation Factor: 14%; Endurance: 2000h; Leakage Current: 3uA; Ripple Current: 85mA; Technical Reference: ASEB055100M025DVCTAB000; Manufacturer Part Number: 865080440002; Category: Aluminum Electrolytic Capacitors; Match Code: WCAP-ASLI; ComponentLink1Description: Website Link; ComponentLink1URL: https://www.we-online.com/redexpert/article/865080440002?ad; ComponentLink2Description: Datasheet Link; ComponentLink2URL: https://www.we-online.com/redexpert/spec/865080440002?ad; Mount: Surface Mount; Operating Temperature Max: 105°C; Operating Temperature Min: -55°C; Packaging: Tape and Reel; Height: 5.5mm; Diameter: 4mm; Capacitance: 10uF; Rated Voltage (DC): 25V
C2 = 865080740002: WCAP-ASLI Aluminum Electrolytic Capacitor, V-Chip, D4 x H5.5mm, 0.1uF, 63V; Manufacturer: Wurth Elektronik; Capacitance Tolerance: +/-20%; Dissipation Factor: 12%; Endurance: 2000h; Leakage Current: 3uA; Ripple Current: 1mA; Technical Reference: ASEB055R10M063DVCTAB000; Manufacturer Part Number: 865080740002; Category: Aluminum Electrolytic Capacitors; Match Code: WCAP-ASLI; ComponentLink1Description: Website Link; ComponentLink1URL: https://www.we-online.com/redexpert/article/865080740002?ad; ComponentLink2Description: Datasheet Link; ComponentLink2URL: https://www.we-online.com/redexpert/spec/865080740002?ad; Mount: Surface Mount; Operating Temperature Max: 105°C; Operating Temperature Min: -55°C; Packaging: Tape and Reel; Height: 5.5mm; Diameter: 4mm; Capacitance: 0.1uF; Rated Voltage (DC): 63V
C3 C4 = TAJC106K016RNJ: 10µF Molded Tantalum Capacitors 16V 2312 (6032 Metric) 2Ohm; MF: AVX Interconnect / Elco; Value: *; MP: TAJC106K016RNJ; Package: 2312 AVX Interconnect / Elco; SnapEDA_Link: https://www.snapeda.com/parts/TAJC106K016RNJ/AVX%20Interconnect%20/%20Elco/view-part/4773/?ref=snap; Price: None; Availability: Unavailable; Check_prices: https://www.snapeda.com/parts/TAJC106K016RNJ/AVX%20Interconnect%20/%20Elco/view-part/4773/?ref=eda
C5 C11 = 885012206095: as C31 on sheet SCH_03_Instrumentation_Amplifier; Manufacturer Part Number: 885012206095; Category: Multilayer Ceramic Chip Capacitors; Match Code: WCAP-CSGP; ComponentLink1Description: Website Link; ComponentLink1URL: https://www.we-online.com/redexpert/article/885012206095?ad; ComponentLink2Description: Datasheet Link; ComponentLink2URL: https://www.we-online.com/redexpert/spec/885012206095?ad; Mount: Surface Mount; Operating Temperature Max: 125°C; Operating Temperature Min: -55°C; Packaging: Tape and Reel; Length: 1.6mm; Width: 0.8mm; Height: 0.8mm; Capacitance: 100nF; Ceramic Type: X7R
C6-C8 C12 = 885012106031: as C56 on sheet SCH_08_ADC; Manufacturer Part Number: 885012106031; Category: Multilayer Ceramic Chip Capacitors; Match Code: WCAP-CSGP; ComponentLink1Description: Website Link; ComponentLink1URL: https://www.we-online.com/redexpert/article/885012106031?ad; ComponentLink2Description: Datasheet Link; ComponentLink2URL: https://www.we-online.com/redexpert/spec/885012106031?ad; Mount: Surface Mount; Operating Temperature Max: 85°C; Operating Temperature Min: -55°C; Packaging: Tape and Reel; Length: 1.6mm; Width: 0.8mm; Height: 0.8mm; Capacitance: 10uF; Ceramic Type: X5R
C9 = 865080245009: WCAP-ASLI Aluminum Electrolytic Capacitor, V-Chip, D6.3 x H7.7mm, 220uF, 10V; Manufacturer: Wurth Elektronik; Capacitance Tolerance: +/-20%; Dissipation Factor: 19%; Endurance: 2000h; Leakage Current: 22uA; Ripple Current: 270mA; Technical Reference: ASED077221M010DVCTCB000; Manufacturer Part Number: 865080245009; Category: Aluminum Electrolytic Capacitors; Match Code: WCAP-ASLI; ComponentLink1Description: Website Link; ComponentLink1URL: https://www.we-online.com/redexpert/article/865080245009?ad; ComponentLink2Description: Datasheet Link; ComponentLink2URL: https://www.we-online.com/redexpert/spec/865080245009?ad; Mount: Surface Mount; Operating Temperature Max: 105°C; Operating Temperature Min: -55°C; Packaging: Tape and Reel; Height: 7.7mm; Diameter: 6.3mm; Capacitance: 220uF; Rated Voltage (DC): 10V
C10 = 885012206126: WCAP-CSGP Multilayer Ceramic Chip Capacitor, General Purpose, size 0603, X7R, 1uF, 50VDC; Manufacturer: Wurth Elektronik; Case/Size Code: 0603; Capacitance Tolerance: +/-10%; Dissipation Factor: 10%; Insulation Resistance: 0.5GOhm; Rated Voltage (DC): 50V; Technical Reference: X7R0603105K050DFCT10000; Manufacturer Part Number: 885012206126; Category: Multilayer Ceramic Chip Capacitors; Match Code: WCAP-CSGP; ComponentLink1Description: Website Link; ComponentLink1URL: https://www.we-online.com/redexpert/article/885012206126?ad; ComponentLink2Description: Datasheet Link; ComponentLink2URL: https://www.we-online.com/redexpert/spec/885012206126?ad; Mount: Surface Mount; Operating Temperature Max: 125°C; Operating Temperature Min: -55°C; Packaging: Tape and Reel; Length: 1.6mm; Width: 0.8mm; Height: 0.8mm; Capacitance: 1uF; Ceramic Type: X7R
D4-D7 = SML-LXT0805IW-TR: LED;Red;11mcd;0.061In.Dia.;SMD;100mA;2V Vf;635nm;140deg;SMD;White Diffused;5V Vr | Lumex SML-LXT0805IW-TR; MF: Lumex Opto/Components; SnapEDA_Link: https://www.snapeda.com/parts/SML-LXT0805IW-TR/Lumex+Opto%252FComponents+Inc./view-part/?ref=snap; Package: 0805 Lumex; Value: *; MP: SML-LXT0805IW-TR; Check_prices: https://www.snapeda.com/parts/SML-LXT0805IW-TR/Lumex+Opto%252FComponents+Inc./view-part/?ref=eda
L1 = 784773147: WE-PD2A SMT Power Inductor, size 4532, 3.3µH, 2A, 3.3Ω; Manufacturer: Wurth Elektronik; Case/Size Code: 4532; DC Resistance: 0.523Ω; DC Resistance Max: 0.844Ω; Inductance: 47µH; Rated Current: 0.68A; Rated Voltage: 80VDC; Saturation Current: 0.77A; Self Resonant Frequency: 12MHz; Manufacturer Part Number: 784773147; Category: Single Coil Power Inductors; Match Code: WE-PD2A; ComponentLink1Description: Website Link; ComponentLink1URL: https://www.we-online.com/redexpert/article/784773147?ad; ComponentLink2Description: Datasheet Link; ComponentLink2URL: https://www.we-online.com/redexpert/spec/784773147?ad; Mount: Surface Mount; Operating Temperature Max: 125°C; Operating Temperature Min: -40°C; Packaging: Tape and Reel; Length: 4.5mm; Width: 4mm; Height: 3.2mm; Automotive: Yes
P1 = TSM-102-01-X-SV: TSM - Samtec 2.54mm Single Row Vertical Surface Mount Header 5.84mm Post Height (01) - Fast Stock; MP: TSM-102-01-L-SV; SnapEDA_Link: https://www.snapeda.com/parts/TSM-102-01-L-SV/Samtec+Inc./view-part/?ref=snap; Package: None; Value: *; MF: Samtec; Check_prices: https://www.snapeda.com/parts/TSM-102-01-L-SV/Samtec+Inc./view-part/?ref=eda
R1-R6 = 580060716001: as R35 on sheet SCH_03_Instrumentation_Amplifier; Manufacturer Part Number: 580060716001; Category: Metal Plate Resistors; Match Code: WRIS-PSMB; ComponentLink1Description: Website Link; ComponentLink1URL: https://www.we-online.com/redexpert/article/580060716001?ad; ComponentLink2Description: Datasheet Link; ComponentLink2URL: https://www.we-online.com/redexpert/spec/580060716001?ad; Mount: Surface Mount; Operating Temperature Max: 155°C; Operating Temperature Min: -55°C; Packaging: Tape and Reel; Length: 1.6mm; Width: 0.8mm; Height: 0.35mm; Rated Power: 0.33W; Resistance: 5mΩ; Resistance Tolerance: +/-1%
U1 = SX1308: SX1308 - Transceiver; LoRaÂ® Evaluation Board; MF: Semtech Corporation; Price: None; Purchase-URL: https://pricing.snapeda.com/search/part/SX1308/?ref=eda; Check_prices: https://www.snapeda.com/parts/SX1308/Semtech+Corporation/view-part/?ref=eda; Value: *; SnapEDA_Link: https://www.snapeda.com/parts/SX1308/Semtech+Corporation/view-part/?ref=snap; Availability: In Stock; MP: SX1308; Package: - Semtech Corporation
U2 = TLE2426: Ground Reference (Virtual) Voltage Reference IC Adjustable 2V 20 VV Â±1% 20 mA 8-PDIP; MF: Texas Instruments; SnapEDA_Link: https://www.snapeda.com/parts/TLE2426/Texas+Instruments/view-part/?ref=snap; Package: None; Value: *; MP: TLE2426; Check_prices: https://www.snapeda.com/parts/TLE2426/Texas+Instruments/view-part/?ref=eda
U3 = AMS1117-5.0: 1A LOW DROPOUT VOLTAGE REGULATOR; MF: ams; MP: AMS1117-5.0; Package: SOT-223 Seeed Technology; SnapEDA_Link: https://www.snapeda.com/parts/AMS1117-5.0/ams/view-part/?ref=snap; Check_prices: https://www.snapeda.com/parts/AMS1117-5.0/ams/view-part/?ref=eda; Availability: Not in stock; Value: *; Price: None
S1 = JS202011SCQN: Price: None; MP: JS202011SCQN; Availability: Unavailable; Value: *; Package: None

## Sheet SCH_06_Analog_Mux.SchDoc
size A4; SheetNumber: 11; SheetTotal: 14; SPICEModelCacheGMSWIORD: <root> / <DocumentId>GMSWIORD</DocumentId> / <CacheFrame Number="0"> / <Model Name="0603_885012206095_100nf" Kind="CKT"> / <Text>******* / .subckt 0603_885012206095_100nF 1 2 / Rser 1 3 0.0157659152881 / Lser 2 4 3.10171966E-10 / C1 3 4 0.0000001 / Rpar 3 4 5000000000 / .ends 0603_885012206095_100nF</Text> / </Model> / </CacheFrame> / </root>
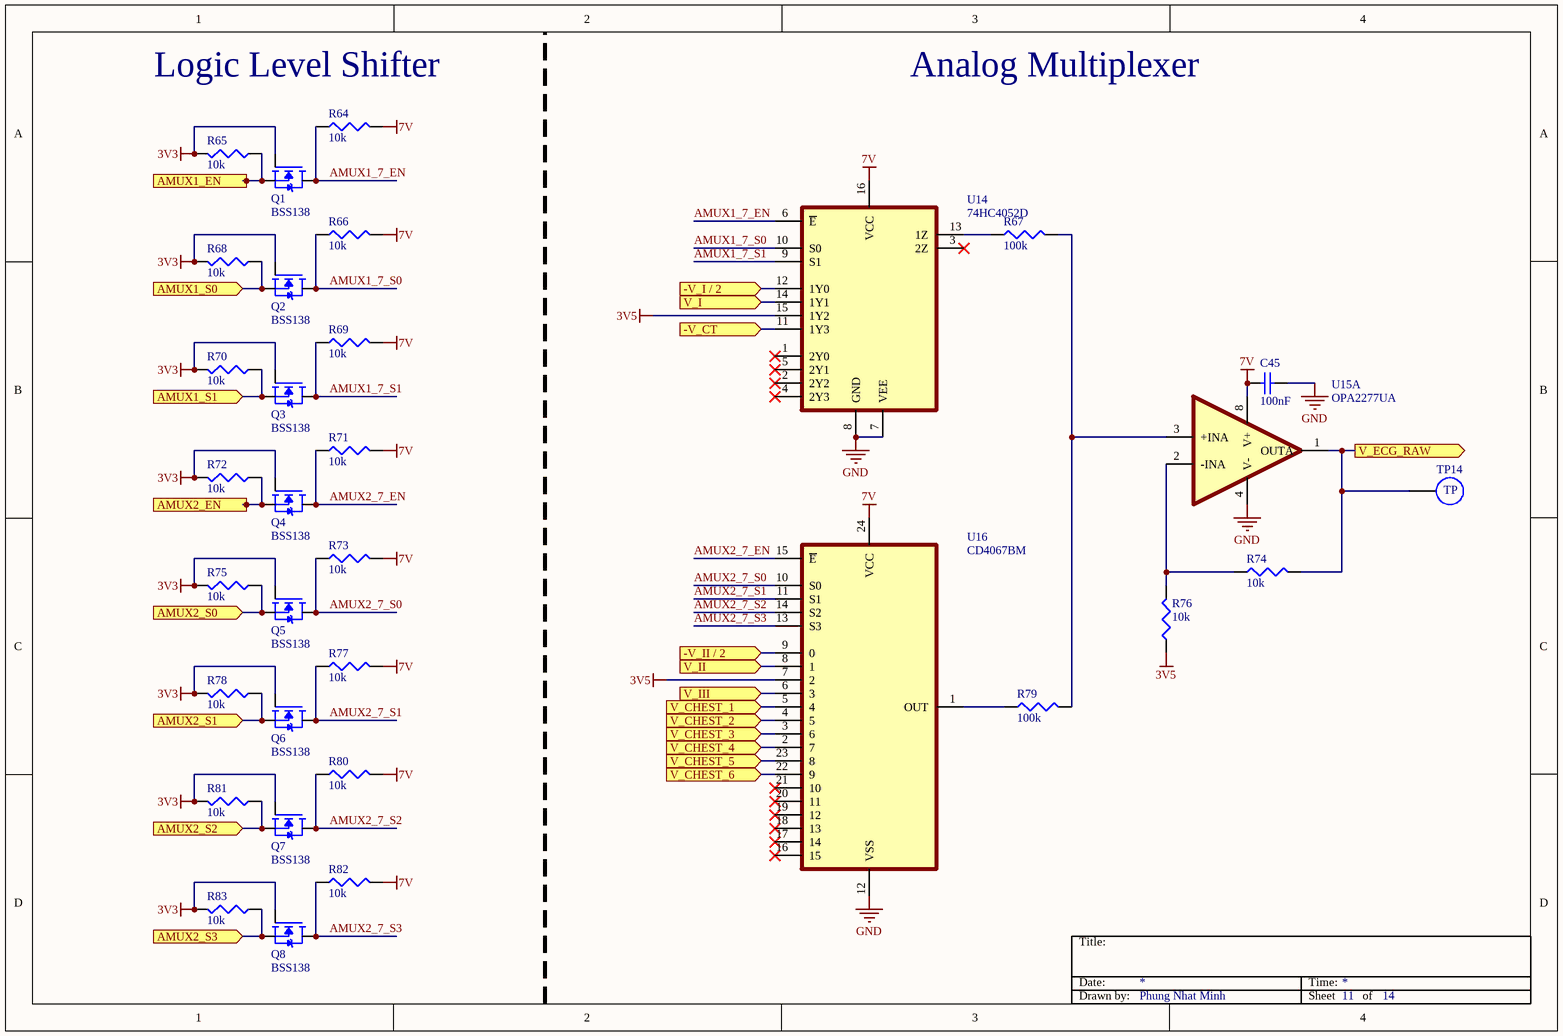
[diagram p7: SCH_06_Analog_Mux.SchDoc]

### Parts
C45  100nF  [WCAP-CSGP_0603_L1.6W0.8H0.8_Reflow]
Q1  BSS138  [SOT95P240X111-3N]
Q2  BSS138  [SOT95P240X111-3N]
Q3  BSS138  [SOT95P240X111-3N]
Q4  BSS138  [SOT95P240X111-3N]
Q5  BSS138  [SOT95P240X111-3N]
Q6  BSS138  [SOT95P240X111-3N]
Q7  BSS138  [SOT95P240X111-3N]
Q8  BSS138  [SOT95P240X111-3N]
R64  10k  [WRIS-PSMB_0603_L1.6W0.8H0.35]
R65  10k  [WRIS-PSMB_0603_L1.6W0.8H0.35]
R66  10k  [WRIS-PSMB_0603_L1.6W0.8H0.35]
R67  100k  [WRIS-PSMB_0603_L1.6W0.8H0.35]
R68  10k  [WRIS-PSMB_0603_L1.6W0.8H0.35]
R69  10k  [WRIS-PSMB_0603_L1.6W0.8H0.35]
R70  10k  [WRIS-PSMB_0603_L1.6W0.8H0.35]
R71  10k  [WRIS-PSMB_0603_L1.6W0.8H0.35]
R72  10k  [WRIS-PSMB_0603_L1.6W0.8H0.35]
R73  10k  [WRIS-PSMB_0603_L1.6W0.8H0.35]
R74  10k  [WRIS-PSMB_0603_L1.6W0.8H0.35]
R75  10k  [WRIS-PSMB_0603_L1.6W0.8H0.35]
R76  10k  [WRIS-PSMB_0603_L1.6W0.8H0.35]
R77  10k  [WRIS-PSMB_0603_L1.6W0.8H0.35]
R78  10k  [WRIS-PSMB_0603_L1.6W0.8H0.35]
R79  100k  [WRIS-PSMB_0603_L1.6W0.8H0.35]
R80  10k  [WRIS-PSMB_0603_L1.6W0.8H0.35]
R81  10k  [WRIS-PSMB_0603_L1.6W0.8H0.35]
R82  10k  [WRIS-PSMB_0603_L1.6W0.8H0.35]
R83  10k  [WRIS-PSMB_0603_L1.6W0.8H0.35]
TP14  Pad_Test_Point  [Pad_Test_Point]  (value not drawn)
U14  74HC4052D  [SOIC127P600X175-16N]
U15  OPA2277UA  [SOIC127P599X175-8N]  (part A of 2)
U16  CD4067BM  [SOIC127P1030X265-24N]

### Ports
-V_CT (in, see Schematic_Top[2B], SCH_05_WCT_RLD[4B]), -V_I / 2 (in, see Schematic_Top[2B], SCH_03_Instrumentation_Amplifier[2B]), -V_II / 2 (in, see Schematic_Top[2B], SCH_03_Instrumentation_Amplifier[4B]), AMUX1_EN (in, see Schematic_Top[3B], SCH_09_InOut_Terminal[2B]), AMUX1_S0 (in, see Schematic_Top[3B], SCH_09_InOut_Terminal[2B]), AMUX1_S1 (in, see Schematic_Top[3B], SCH_09_InOut_Terminal[2B]), AMUX2_EN (in, see Schematic_Top[3B], SCH_09_InOut_Terminal[3B]), AMUX2_S0 (in, see Schematic_Top[3B], SCH_09_InOut_Terminal[3B]), AMUX2_S1 (in, see Schematic_Top[3B], SCH_09_InOut_Terminal[3B]), AMUX2_S2 (in, see Schematic_Top[3B], SCH_09_InOut_Terminal[3B]), AMUX2_S3 (in, see Schematic_Top[3C], SCH_09_InOut_Terminal[3B]), V_CHEST_1 (in, see Schematic_Top[2C], SCH_04_Chest_Lead_Amplifier[2B]), V_CHEST_2 (in, see Schematic_Top[2C], SCH_04_Chest_Lead_Amplifier[4B]), V_CHEST_3 (in, see Schematic_Top[2C], SCH_04_Chest_Lead_Amplifier[2C]), V_CHEST_4 (in, see Schematic_Top[2C], SCH_04_Chest_Lead_Amplifier[4C]), V_CHEST_5 (in, see Schematic_Top[2C], SCH_04_Chest_Lead_Amplifier[2D]), V_CHEST_6 (in, see Schematic_Top[2C], SCH_04_Chest_Lead_Amplifier[4D]), V_ECG_RAW (out, see Schematic_Top[3A], SCH_07_Filter[1B]), V_I (in, see Schematic_Top[2A], SCH_03_Instrumentation_Amplifier[4C]), V_II (in, see Schematic_Top[2B], SCH_03_Instrumentation_Amplifier[4D]), V_III (in, see Schematic_Top[2B], SCH_03_Instrumentation_Amplifier[2C])

### Nets
3V3: Q1.1(G) Q2.1(G) Q3.1(G) Q4.1(G) Q5.1(G) Q6.1(G) Q7.1(G) Q8.1(G) R65.2 R68.2 R70.2 R72.2 R75.2 R78.2 R81.2 R83.2
3V5: R76.1 U14.15(1Y2) U16.7(2)
7V: C45.2 R64.2 R66.2 R69.2 R71.2 R73.2 R77.2 R80.2 R82.2 U14.16(VCC) U15.8(V+) U16.24(VCC)
GND: C45.1 U14.7(VEE) U14.8(GND) U15.4(V-) U16.12(VSS)
-V_I / 2: U14.12(1Y0) ; port -V_I / 2
-V_II / 2: U16.9(0) ; port -V_II / 2
AMUX1_7_EN: Q1.3(D) R64.1 U14.6(~{E})
AMUX1_7_S0: Q2.3(D) R66.1 U14.10(S0)
AMUX1_7_S1: Q3.3(D) R69.1 U14.9(S1)
AMUX2_7_EN: Q4.3(D) R71.1 U16.15(~{E})
AMUX2_7_S0: Q5.3(D) R73.1 U16.10(S0)
AMUX2_7_S1: Q6.3(D) R77.1 U16.11(S1)
AMUX2_7_S2: Q7.3(D) R80.1 U16.14(S2)
AMUX2_7_S3: Q8.3(D) R82.1 U16.13(S3)
NetJ5_29: Q8.2(S) R83.1 ; port AMUX2_S3
NetJ5_31: Q7.2(S) R81.1 ; port AMUX2_S2
NetJ5_33: Q6.2(S) R78.1 ; port AMUX2_S1
NetJ5_35: Q5.2(S) R75.1 ; port AMUX2_S0
NetJ5_36: Q3.2(S) R70.1 ; port AMUX1_S1
NetJ5_37: Q4.2(S) R72.1 ; port AMUX2_EN
NetJ5_38: Q2.2(S) R68.1 ; port AMUX1_S0
NetJ5_40: Q1.2(S) R65.1 ; port AMUX1_EN
NetR39_2: U14.14(1Y1) ; port V_I
NetR41_2: U16.8(1) ; port V_II
NetR42_2: U16.5(4) ; port V_CHEST_1
NetR43_2: U16.4(5) ; port V_CHEST_2
NetR46_2: U16.3(6) ; port V_CHEST_3
NetR47_2: U16.2(7) ; port V_CHEST_4
NetR50_2: U16.23(8) ; port V_CHEST_5
NetR51_2: U16.22(9) ; port V_CHEST_6
NetR56_2: U14.11(1Y3) ; port -V_CT
NetR67_1: R67.1 U14.13(1Z)
NetR67_2: R67.2 R79.2 U15.3(+INA)
NetR74_1: R74.1 R76.2 U15.2(-INA)
NetR74_2: R74.2 TP14.1 U15.1(OUTA) ; port V_ECG_RAW
NetR79_1: R79.1 U16.1(OUT)
NetTP4_1: U16.6(3) ; port V_III

Not connected (* = marked no-connect by the designer): U14 1(2Y0)* 2(2Y2)* 3(2Z)* 4(2Y3)* 5(2Y1)*; U16 16(15)* 17(14)* 18(13)* 19(12)* 20(11)* 21(10)*

### Notes on the sheet
- (near R64) Logic Level Shifter
- Analog Multiplexer
- Title:
- Date:
- Time:
- Drawn by:
- Phung Nhat Minh
- Sheet
- of
- (in symbol Pad_Test_Point) TP

### Library data of the parts
C45 = 885012206095: as C31 on sheet SCH_03_Instrumentation_Amplifier; Manufacturer Part Number: 885012206095; Category: Multilayer Ceramic Chip Capacitors; Match Code: WCAP-CSGP; ComponentLink1Description: Website Link; ComponentLink1URL: https://www.we-online.com/redexpert/article/885012206095?ad; ComponentLink2Description: Datasheet Link; ComponentLink2URL: https://www.we-online.com/redexpert/spec/885012206095?ad; Mount: Surface Mount; Operating Temperature Max: 125°C; Operating Temperature Min: -55°C; Packaging: Tape and Reel; Length: 1.6mm; Width: 0.8mm; Height: 0.8mm; Capacitance: 100nF; Ceramic Type: X7R
Q1-Q8 = BSS138: N-Channel 50V 220mA (Ta) 360mW (Ta) Surface Mount SOT-23-3; MF: ON Semiconductor; MP: BSS138; Price: None; SnapEDA_Link: https://www.snapeda.com/parts/BSS138/ON%20Semiconductor/view-part/4794929/?ref=snap; Availability: Good; Purchase-URL: https://pricing.snapeda.com/search/part/BSS138/?ref=eda; Value: *; Check_prices: https://www.snapeda.com/parts/BSS138/ON%20Semiconductor/view-part/4794929/?ref=eda; Package: SOT-23 ON Semiconductor
R64-R83 = 580060716001: as R35 on sheet SCH_03_Instrumentation_Amplifier; Manufacturer Part Number: 580060716001; Category: Metal Plate Resistors; Match Code: WRIS-PSMB; ComponentLink1Description: Website Link; ComponentLink1URL: https://www.we-online.com/redexpert/article/580060716001?ad; ComponentLink2Description: Datasheet Link; ComponentLink2URL: https://www.we-online.com/redexpert/spec/580060716001?ad; Mount: Surface Mount; Operating Temperature Max: 155°C; Operating Temperature Min: -55°C; Packaging: Tape and Reel; Length: 1.6mm; Width: 0.8mm; Height: 0.35mm; Rated Power: 0.33W; Resistance: 5mΩ; Resistance Tolerance: +/-1%
U14 = 74HC4052D: 2 Circuit IC Switch 4:1 150Ohm 16-SO; MP: 74HC4052D,653; MF: Nexperia USA; SnapEDA_Link: https://www.snapeda.com/parts/74HC4052D,653/Nexperia/view-part/32196/?ref=snap; Purchase-URL: https://pricing.snapeda.com/search/part/74HC4052D,653/?ref=eda; Availability: Good; Value: *; Price: None; Package: SO16-16 Nexperia USA Inc.; Check_prices: https://www.snapeda.com/parts/74HC4052D,653/Nexperia/view-part/32196/?ref=eda
U15 = OPA2277UA: MP: OPA2227UA; Package: None; Price: None; Value: *; Availability: Unavailable

## Sheet SCH_09_InOut_Terminal.SchDoc
size A4; SheetNumber: 14; SheetTotal: 14
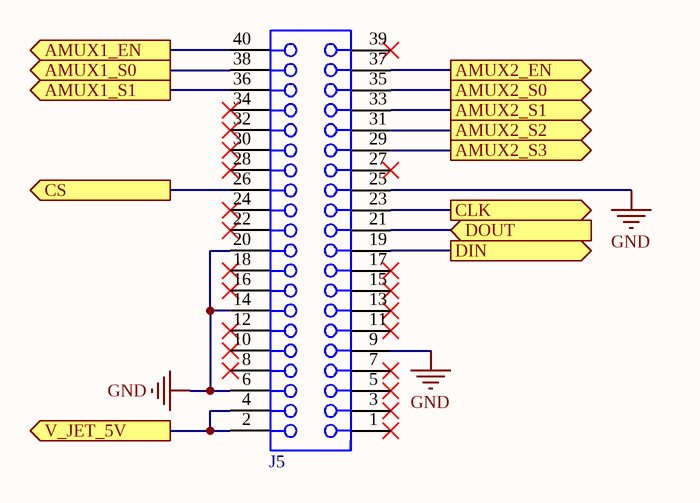
[diagram p8: SCH_09_InOut_Terminal.SchDoc]

### Parts
J5  613040243121  [613040243121]  (value not drawn)

### Ports
AMUX1_EN (out, see Schematic_Top[4B], SCH_06_Analog_Mux[1A]), AMUX1_S0 (out, see Schematic_Top[4B], SCH_06_Analog_Mux[1B]), AMUX1_S1 (out, see Schematic_Top[4B], SCH_06_Analog_Mux[1B]), AMUX2_EN (out, see Schematic_Top[4B], SCH_06_Analog_Mux[1B]), AMUX2_S0 (out, see Schematic_Top[4B], SCH_06_Analog_Mux[1C]), AMUX2_S1 (out, see Schematic_Top[4B], SCH_06_Analog_Mux[1C]), AMUX2_S2 (out, see Schematic_Top[4B], SCH_06_Analog_Mux[1D]), AMUX2_S3 (out, see Schematic_Top[4C], SCH_06_Analog_Mux[1D]), CLK (out, see Schematic_Top[4B], SCH_08_ADC[3C]), CS (out, see Schematic_Top[4A], SCH_08_ADC[3B]), DIN (out, see Schematic_Top[4B], SCH_08_ADC[3C]), DOUT (in, see Schematic_Top[4B], SCH_08_ADC[3C]), V_JET_5V (out, see Schematic_Top[4C], SCH_01_Power[1A])

### Nets
GND: J5.6 J5.9 J5.14 J5.20 J5.25
V_JET_5V: J5.2 J5.4 ; port V_JET_5V
NetJ5_19: J5.19 ; port DIN
NetJ5_21: J5.21 ; port DOUT
NetJ5_23: J5.23 ; port CLK
NetJ5_26: J5.26 ; port CS
NetJ5_29: J5.29 ; port AMUX2_S3
NetJ5_31: J5.31 ; port AMUX2_S2
NetJ5_33: J5.33 ; port AMUX2_S1
NetJ5_35: J5.35 ; port AMUX2_S0
NetJ5_36: J5.36 ; port AMUX1_S1
NetJ5_37: J5.37 ; port AMUX2_EN
NetJ5_38: J5.38 ; port AMUX1_S0
NetJ5_40: J5.40 ; port AMUX1_EN

Not connected (* = marked no-connect by the designer): J5 1* 3* 5* 7* 8* 10* 11* 12* 13* 15* 16* 17* 18* 22* 24* 27* 28* 30* 32* 34* 39*

### Notes on the sheet
- Title:
- Date:
- Time:
- Drawn by:
- Phung Nhat Minh
- Sheet
- of

### Library data of the parts
J5 = 613040243121: WR-PHD Socket Header, THT, Angled, pitch 2.54mm, 2 Row, 40P; Manufacturer: Wurth Elektronik; Contact Resistance: 20mOhm; Rated Current: 3A; Working Voltage: 250V; Withstanding Voltage: 500V; Manufacturer Part Number: 613040243121; Category: Board-to-Board Connectors; Match Code: WR-PHD; ComponentLink1Description: Website Link; ComponentLink1URL: https://www.we-online.com/redexpert/article/613040243121?ad; ComponentLink2Description: Datasheet Link; ComponentLink2URL: https://www.we-online.com/redexpert/spec/613040243121?ad; Mount: Through Hole; Operating Temperature Max: 125°C; Operating Temperature Min: -40°C; Packaging: Tray; Gender: Socket Header; Number of Pins: 40; Number of Rows: 2; Orientation: Angled; Pitch: 2.54mm

## Sheet SCH_02_Electrodes.SchDoc
size A4; SheetNumber: 7; SheetTotal: 14; SPICEModelCacheCJDBAQCP: <root> / <DocumentId>CJDBAQCP</DocumentId> / </root>
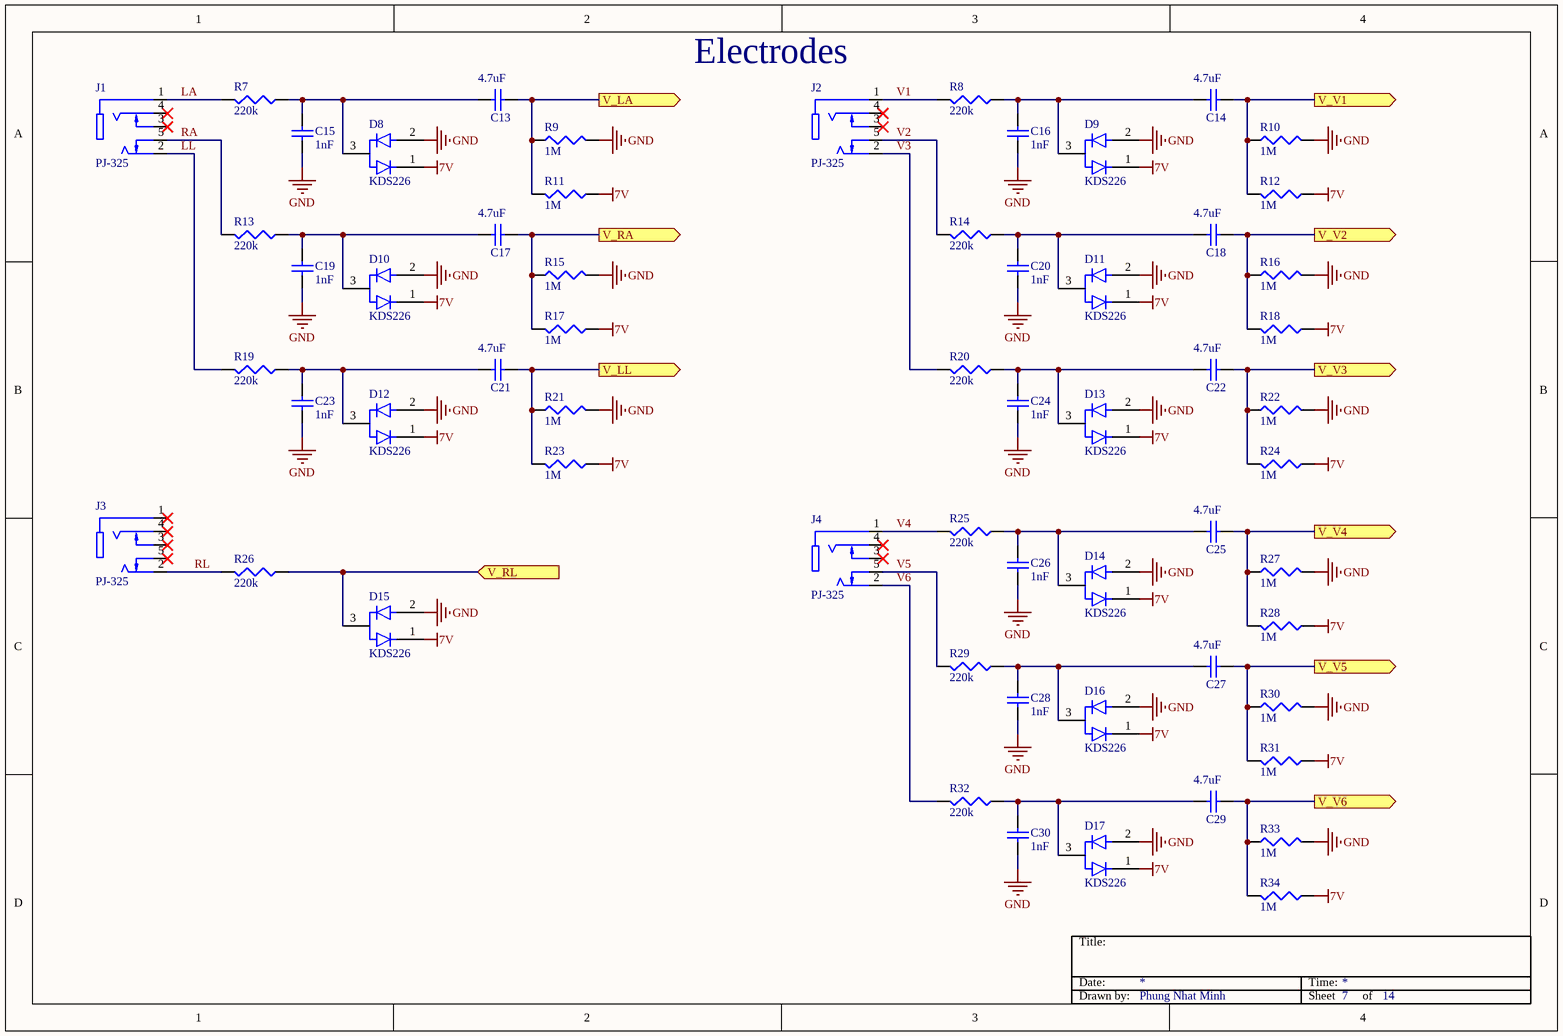
[diagram p9: SCH_02_Electrodes.SchDoc]

### Parts
C13  4.7uF  [WCAP-CSGP_0603_L1.6W0.8H0.8_Reflow]
C14  4.7uF  [WCAP-CSGP_0603_L1.6W0.8H0.8_Reflow]
C15  1nF  [WCAP-CSGP_0603_L1.6W0.8H0.8_Reflow]
C16  1nF  [WCAP-CSGP_0603_L1.6W0.8H0.8_Reflow]
C17  4.7uF  [WCAP-CSGP_0603_L1.6W0.8H0.8_Reflow]
C18  4.7uF  [WCAP-CSGP_0603_L1.6W0.8H0.8_Reflow]
C19  1nF  [WCAP-CSGP_0603_L1.6W0.8H0.8_Reflow]
C20  1nF  [WCAP-CSGP_0603_L1.6W0.8H0.8_Reflow]
C21  4.7uF  [WCAP-CSGP_0603_L1.6W0.8H0.8_Reflow]
C22  4.7uF  [WCAP-CSGP_0603_L1.6W0.8H0.8_Reflow]
C23  1nF  [WCAP-CSGP_0603_L1.6W0.8H0.8_Reflow]
C24  1nF  [WCAP-CSGP_0603_L1.6W0.8H0.8_Reflow]
C25  4.7uF  [WCAP-CSGP_0603_L1.6W0.8H0.8_Reflow]
C26  1nF  [WCAP-CSGP_0603_L1.6W0.8H0.8_Reflow]
C27  4.7uF  [WCAP-CSGP_0603_L1.6W0.8H0.8_Reflow]
C28  1nF  [WCAP-CSGP_0603_L1.6W0.8H0.8_Reflow]
C29  4.7uF  [WCAP-CSGP_0603_L1.6W0.8H0.8_Reflow]
C30  1nF  [WCAP-CSGP_0603_L1.6W0.8H0.8_Reflow]
D8  KDS226  [DIO_BAV99]
D9  KDS226  [DIO_BAV99]
D10  KDS226  [DIO_BAV99]
D11  KDS226  [DIO_BAV99]
D12  KDS226  [DIO_BAV99]
D13  KDS226  [DIO_BAV99]
D14  KDS226  [DIO_BAV99]
D15  KDS226  [DIO_BAV99]
D16  KDS226  [DIO_BAV99]
D17  KDS226  [DIO_BAV99]
J1  value PJ-325  [3.5 mm, Strereo]  (hidden comment: PJ-324)
J2  value PJ-325  [3.5 mm, Strereo]  (hidden comment: PJ-324)
J3  value PJ-325  [3.5 mm, Strereo]  (hidden comment: PJ-324)
J4  value PJ-325  [3.5 mm, Strereo]  (hidden comment: PJ-324)
R7  220k  [WRIS-PSMB_0603_L1.6W0.8H0.35]
R8  220k  [WRIS-PSMB_0603_L1.6W0.8H0.35]
R9  1M  [WRIS-PSMB_0603_L1.6W0.8H0.35]
R10  1M  [WRIS-PSMB_0603_L1.6W0.8H0.35]
R11  1M  [WRIS-PSMB_0603_L1.6W0.8H0.35]
R12  1M  [WRIS-PSMB_0603_L1.6W0.8H0.35]
R13  220k  [WRIS-PSMB_0603_L1.6W0.8H0.35]
R14  220k  [WRIS-PSMB_0603_L1.6W0.8H0.35]
R15  1M  [WRIS-PSMB_0603_L1.6W0.8H0.35]
R16  1M  [WRIS-PSMB_0603_L1.6W0.8H0.35]
R17  1M  [WRIS-PSMB_0603_L1.6W0.8H0.35]
R18  1M  [WRIS-PSMB_0603_L1.6W0.8H0.35]
R19  220k  [WRIS-PSMB_0603_L1.6W0.8H0.35]
R20  220k  [WRIS-PSMB_0603_L1.6W0.8H0.35]
R21  1M  [WRIS-PSMB_0603_L1.6W0.8H0.35]
R22  1M  [WRIS-PSMB_0603_L1.6W0.8H0.35]
R23  1M  [WRIS-PSMB_0603_L1.6W0.8H0.35]
R24  1M  [WRIS-PSMB_0603_L1.6W0.8H0.35]
R25  220k  [WRIS-PSMB_0603_L1.6W0.8H0.35]
R26  220k  [WRIS-PSMB_0603_L1.6W0.8H0.35]
R27  1M  [WRIS-PSMB_0603_L1.6W0.8H0.35]
R28  1M  [WRIS-PSMB_0603_L1.6W0.8H0.35]
R29  220k  [WRIS-PSMB_0603_L1.6W0.8H0.35]
R30  1M  [WRIS-PSMB_0603_L1.6W0.8H0.35]
R31  1M  [WRIS-PSMB_0603_L1.6W0.8H0.35]
R32  220k  [WRIS-PSMB_0603_L1.6W0.8H0.35]
R33  1M  [WRIS-PSMB_0603_L1.6W0.8H0.35]
R34  1M  [WRIS-PSMB_0603_L1.6W0.8H0.35]

### Ports
V_LA (out, see Schematic_Top[1A], SCH_03_Instrumentation_Amplifier[1A], SCH_05_WCT_RLD[1A]), V_LL (out, see Schematic_Top[1B], SCH_03_Instrumentation_Amplifier[1A], SCH_05_WCT_RLD[1B]), V_RA (out, see Schematic_Top[1B], SCH_03_Instrumentation_Amplifier[1A], SCH_05_WCT_RLD[1B]), V_RL (in, see Schematic_Top[1B], SCH_05_WCT_RLD[2D]), V_V1 (out, see Schematic_Top[1C], SCH_04_Chest_Lead_Amplifier[1B]), V_V2 (out, see Schematic_Top[1C], SCH_04_Chest_Lead_Amplifier[3B]), V_V3 (out, see Schematic_Top[1C], SCH_04_Chest_Lead_Amplifier[1C]), V_V4 (out, see Schematic_Top[1C], SCH_04_Chest_Lead_Amplifier[3C]), V_V5 (out, see Schematic_Top[1C], SCH_04_Chest_Lead_Amplifier[1D]), V_V6 (out, see Schematic_Top[1C], SCH_04_Chest_Lead_Amplifier[3D])

### Nets
7V: D8.1 D9.1 D10.1 D11.1 D12.1 D13.1 D14.1 D15.1 D16.1 D17.1 R11.1 R12.1 R17.1 R18.1 R23.1 R24.1 R28.1 R31.1 R34.1
GND: C15.2 C16.2 C19.2 C20.2 C23.2 C24.2 C26.2 C28.2 C30.2 D8.2 D9.2 D10.2 D11.2 D12.2 D13.2 D14.2 D15.2 D16.2 D17.2 R9.2 R10.2 R15.2 R16.2 R21.2 R22.2 R27.2 R30.2 R33.2
LA: J1.1 R7.2
LL: J1.2 R19.2
RA: J1.5 R13.2
RL: J3.2 R26.2
V1: J2.1 R8.2
V2: J2.5 R14.2
V3: J2.2 R20.2
V4: J4.1 R25.2
V5: J4.5 R29.2
V6: J4.2 R32.2
V_LA: C13.2 R9.1 R11.2 ; port V_LA
V_LL: C21.2 R21.1 R23.2 ; port V_LL
V_RA: C17.2 R15.1 R17.2 ; port V_RA
NetC13_1: C13.1 C15.1 D8.3 R7.1
NetC14_1: C14.1 C16.1 D9.3 R8.1
NetC14_2: C14.2 R10.1 R12.2 ; port V_V1
NetC17_1: C17.1 C19.1 D10.3 R13.1
NetC18_1: C18.1 C20.1 D11.3 R14.1
NetC18_2: C18.2 R16.1 R18.2 ; port V_V2
NetC21_1: C21.1 C23.1 D12.3 R19.1
NetC22_1: C22.1 C24.1 D13.3 R20.1
NetC22_2: C22.2 R22.1 R24.2 ; port V_V3
NetC25_1: C25.1 C26.1 D14.3 R25.1
NetC25_2: C25.2 R27.1 R28.2 ; port V_V4
NetC27_1: C27.1 C28.1 D16.3 R29.1
NetC27_2: C27.2 R30.1 R31.2 ; port V_V5
NetC29_1: C29.1 C30.1 D17.3 R32.1
NetC29_2: C29.2 R33.1 R34.2 ; port V_V6
NetC43_2: D15.3 R26.1 ; port V_RL

Not connected (* = marked no-connect by the designer): J1 3* 4*; J2 3* 4*; J3 1* 3* 4* 5*; J4 3* 4*

### Notes on the sheet
- (near J2) Electrodes
- Title:
- Date:
- Time:
- Drawn by:
- Phung Nhat Minh
- Sheet
- of

### Library data of the parts
C13 C14 C17 C18 C21 C22 C25 C27 C29 = 885012106012: WCAP-CSGP Multilayer Ceramic Chip Capacitor, General Purpose, size 0603, X5R, 4.7uF, 10VDC; Manufacturer: Wurth Elektronik; Case/Size Code: 0603; Capacitance Tolerance: +/-20%; Dissipation Factor: 10%; Insulation Resistance: 0.02GOhm; Rated Voltage (DC): 10V; Technical Reference: X5R0603475M010DFCT10000; Manufacturer Part Number: 885012106012; Category: Multilayer Ceramic Chip Capacitors; Match Code: WCAP-CSGP; ComponentLink1Description: Website Link; ComponentLink1URL: https://www.we-online.com/redexpert/article/885012106012?ad; ComponentLink2Description: Datasheet Link; ComponentLink2URL: https://www.we-online.com/redexpert/spec/885012106012?ad; Mount: Surface Mount; Operating Temperature Max: 85°C; Operating Temperature Min: -55°C; Packaging: Tape and Reel; Length: 1.6mm; Width: 0.8mm; Height: 0.8mm; Capacitance: 4.7uF; Ceramic Type: X5R
C15 C16 C19 C20 C23 C24 C26 C28 C30 = 885012006063: WCAP-CSGP Multilayer Ceramic Chip Capacitor, General Purpose, size 0603, NP0, 1nF, 50VDC; Manufacturer: Wurth Elektronik; Case/Size Code: 0603; Capacitance Tolerance: +/-5%; Insulation Resistance: 10GOhm; Q Factor: 1000; Rated Voltage (DC): 50V; Technical Reference: NP00603102J050DFCT10000; Manufacturer Part Number: 885012006063; Category: Multilayer Ceramic Chip Capacitors; Match Code: WCAP-CSGP; ComponentLink1Description: Website Link; ComponentLink1URL: https://www.we-online.com/redexpert/article/885012006063?ad; ComponentLink2Description: Datasheet Link; ComponentLink2URL: https://www.we-online.com/redexpert/spec/885012006063?ad; Mount: Surface Mount; Operating Temperature Max: 125°C; Operating Temperature Min: -55°C; Packaging: Tape and Reel; Length: 1.6mm; Width: 0.8mm; Height: 0.8mm; Capacitance: 1nF; Ceramic Type: NP0
D8-D17 = KDS226: Diode Array 1 Pair Series Connection Standard 100V 215mA (DC) Surface Mount TO-236-3, SC-59, SOT-23-3; MP: BAV99; MF: ON Semiconductor; Price: None; Availability: In Stock; Package: SOT-23-3 Motorola; SnapEDA_Link: https://www.snapeda.com/parts/BAV99/Onsemi/view-part/?ref=snap; Check_prices: https://www.snapeda.com/parts/BAV99/Onsemi/view-part/?ref=eda; Value: *; Purchase-URL: https://pricing.snapeda.com/search/part/BAV99/?ref=eda
J1-J4 = PJ-324: Jack 3.5 3-Pole 5-Pin; ComponentLink1Description: Buy; ComponentLink1URL: https://www.thegioiic.com/pj-324-cong-audio-3-5mm-3-cuc-5-chan-han-pcb
R7-R34 = 580060716001: as R35 on sheet SCH_03_Instrumentation_Amplifier; Manufacturer Part Number: 580060716001; Category: Metal Plate Resistors; Match Code: WRIS-PSMB; ComponentLink1Description: Website Link; ComponentLink1URL: https://www.we-online.com/redexpert/article/580060716001?ad; ComponentLink2Description: Datasheet Link; ComponentLink2URL: https://www.we-online.com/redexpert/spec/580060716001?ad; Mount: Surface Mount; Operating Temperature Max: 155°C; Operating Temperature Min: -55°C; Packaging: Tape and Reel; Length: 1.6mm; Width: 0.8mm; Height: 0.35mm; Rated Power: 0.33W; Resistance: 5mΩ; Resistance Tolerance: +/-1%